# EAGLE schematic proto4 (EAGLE 6.6.0), part 1 of 2
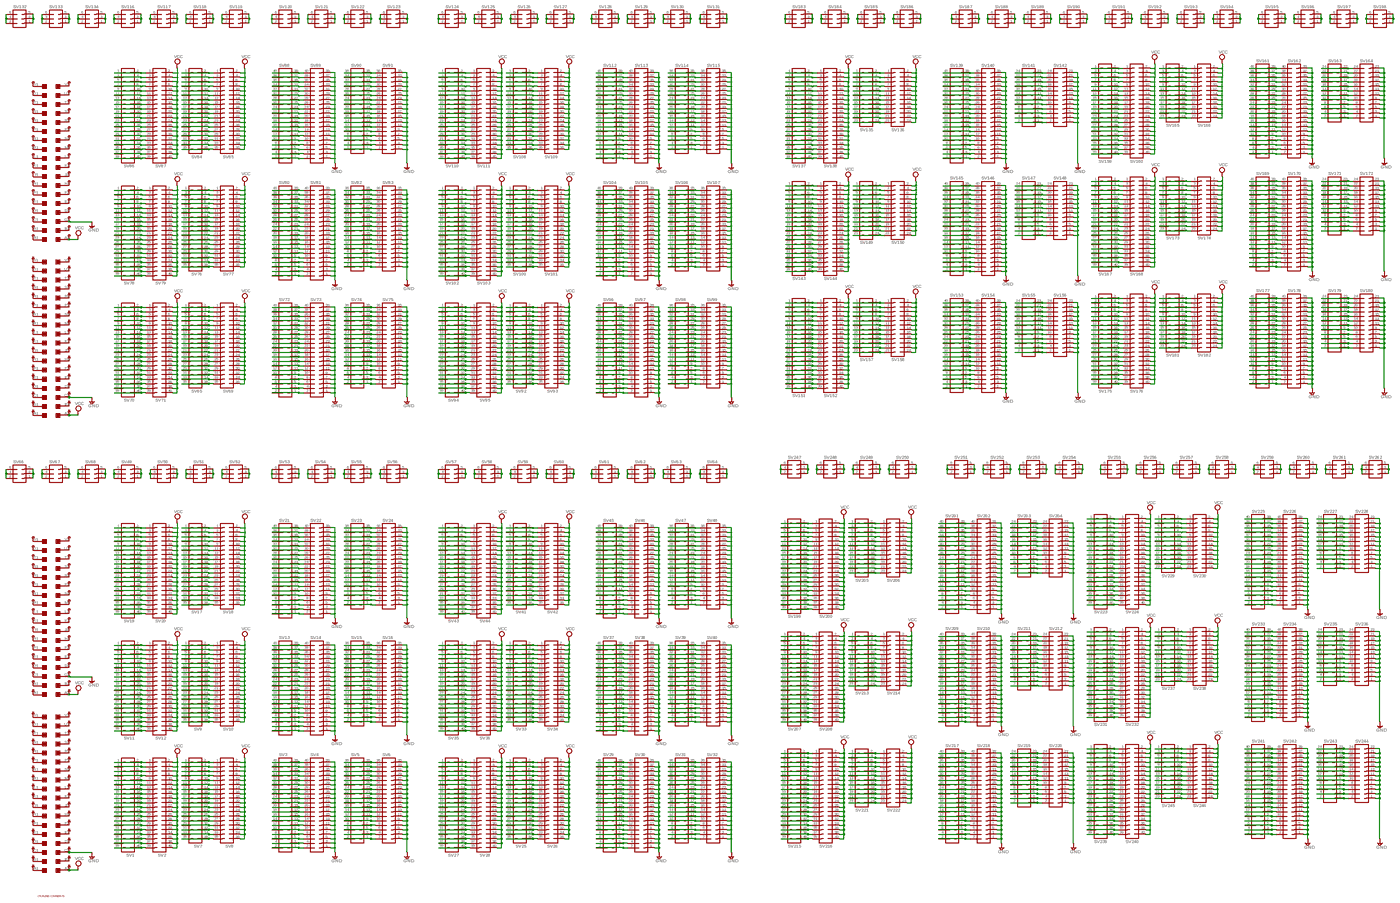
[diagram p0: schematic, sheet 1, overview]
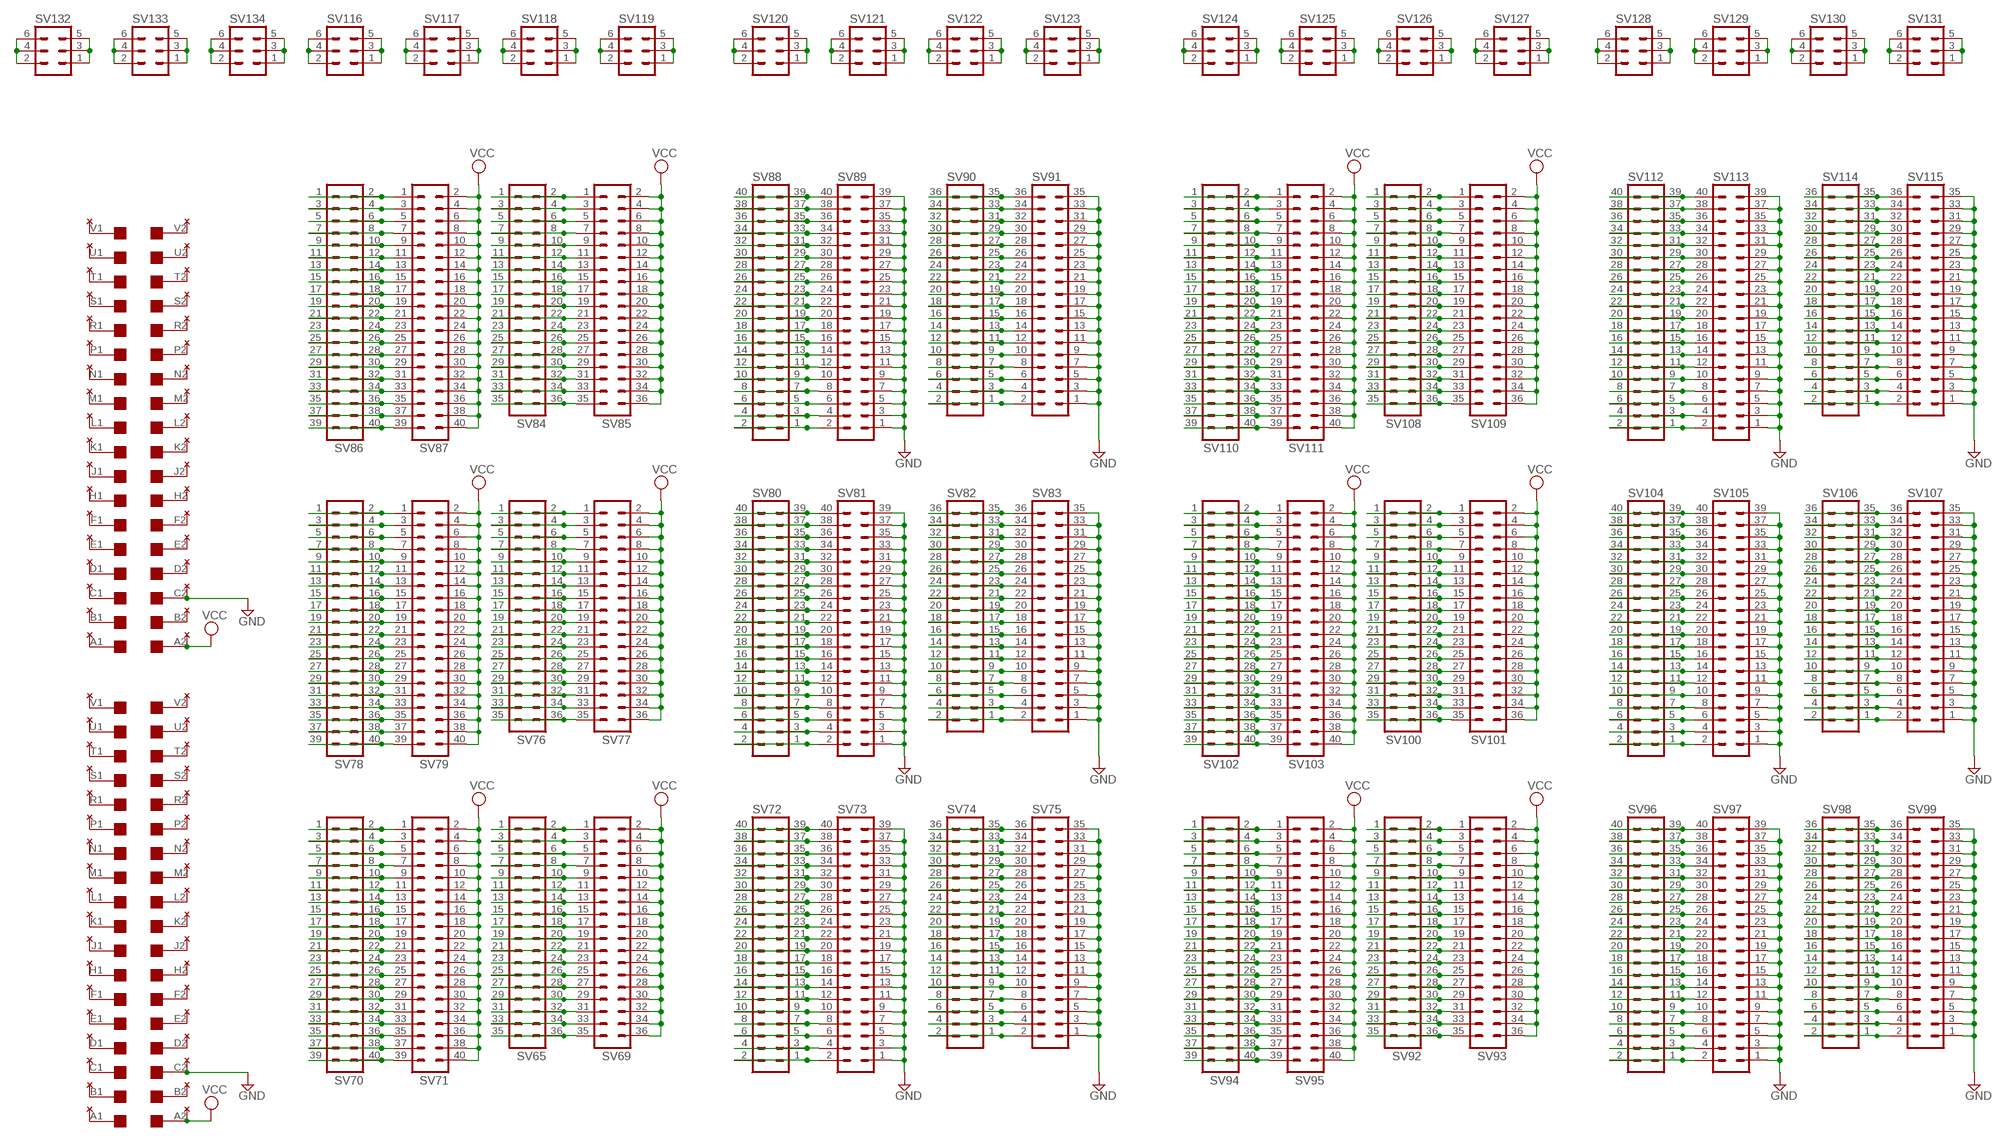
[diagram p1: schematic, sheet 1, part 1 of 4]
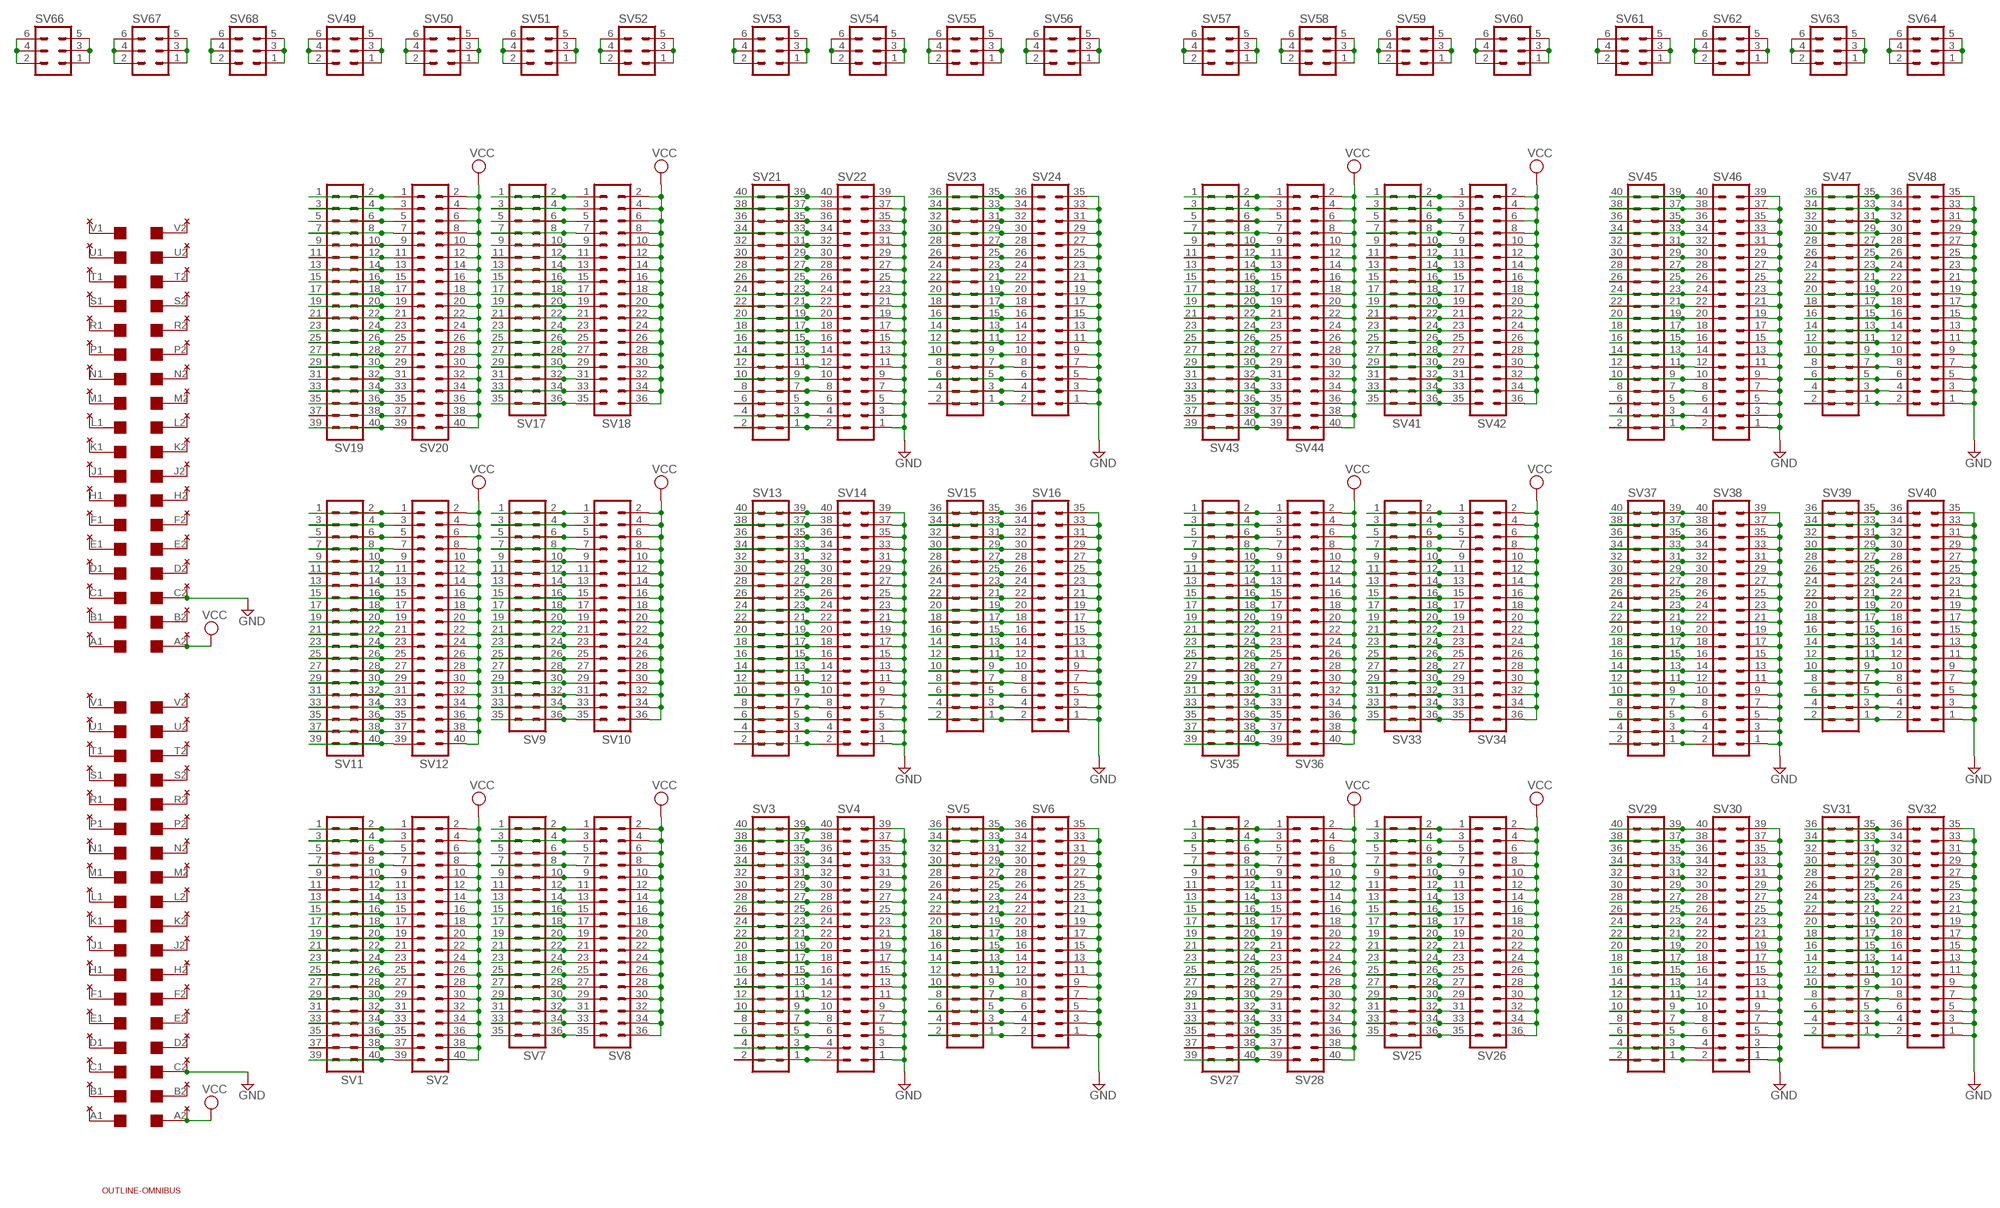
[diagram p2: schematic, sheet 1, part 2 of 4]
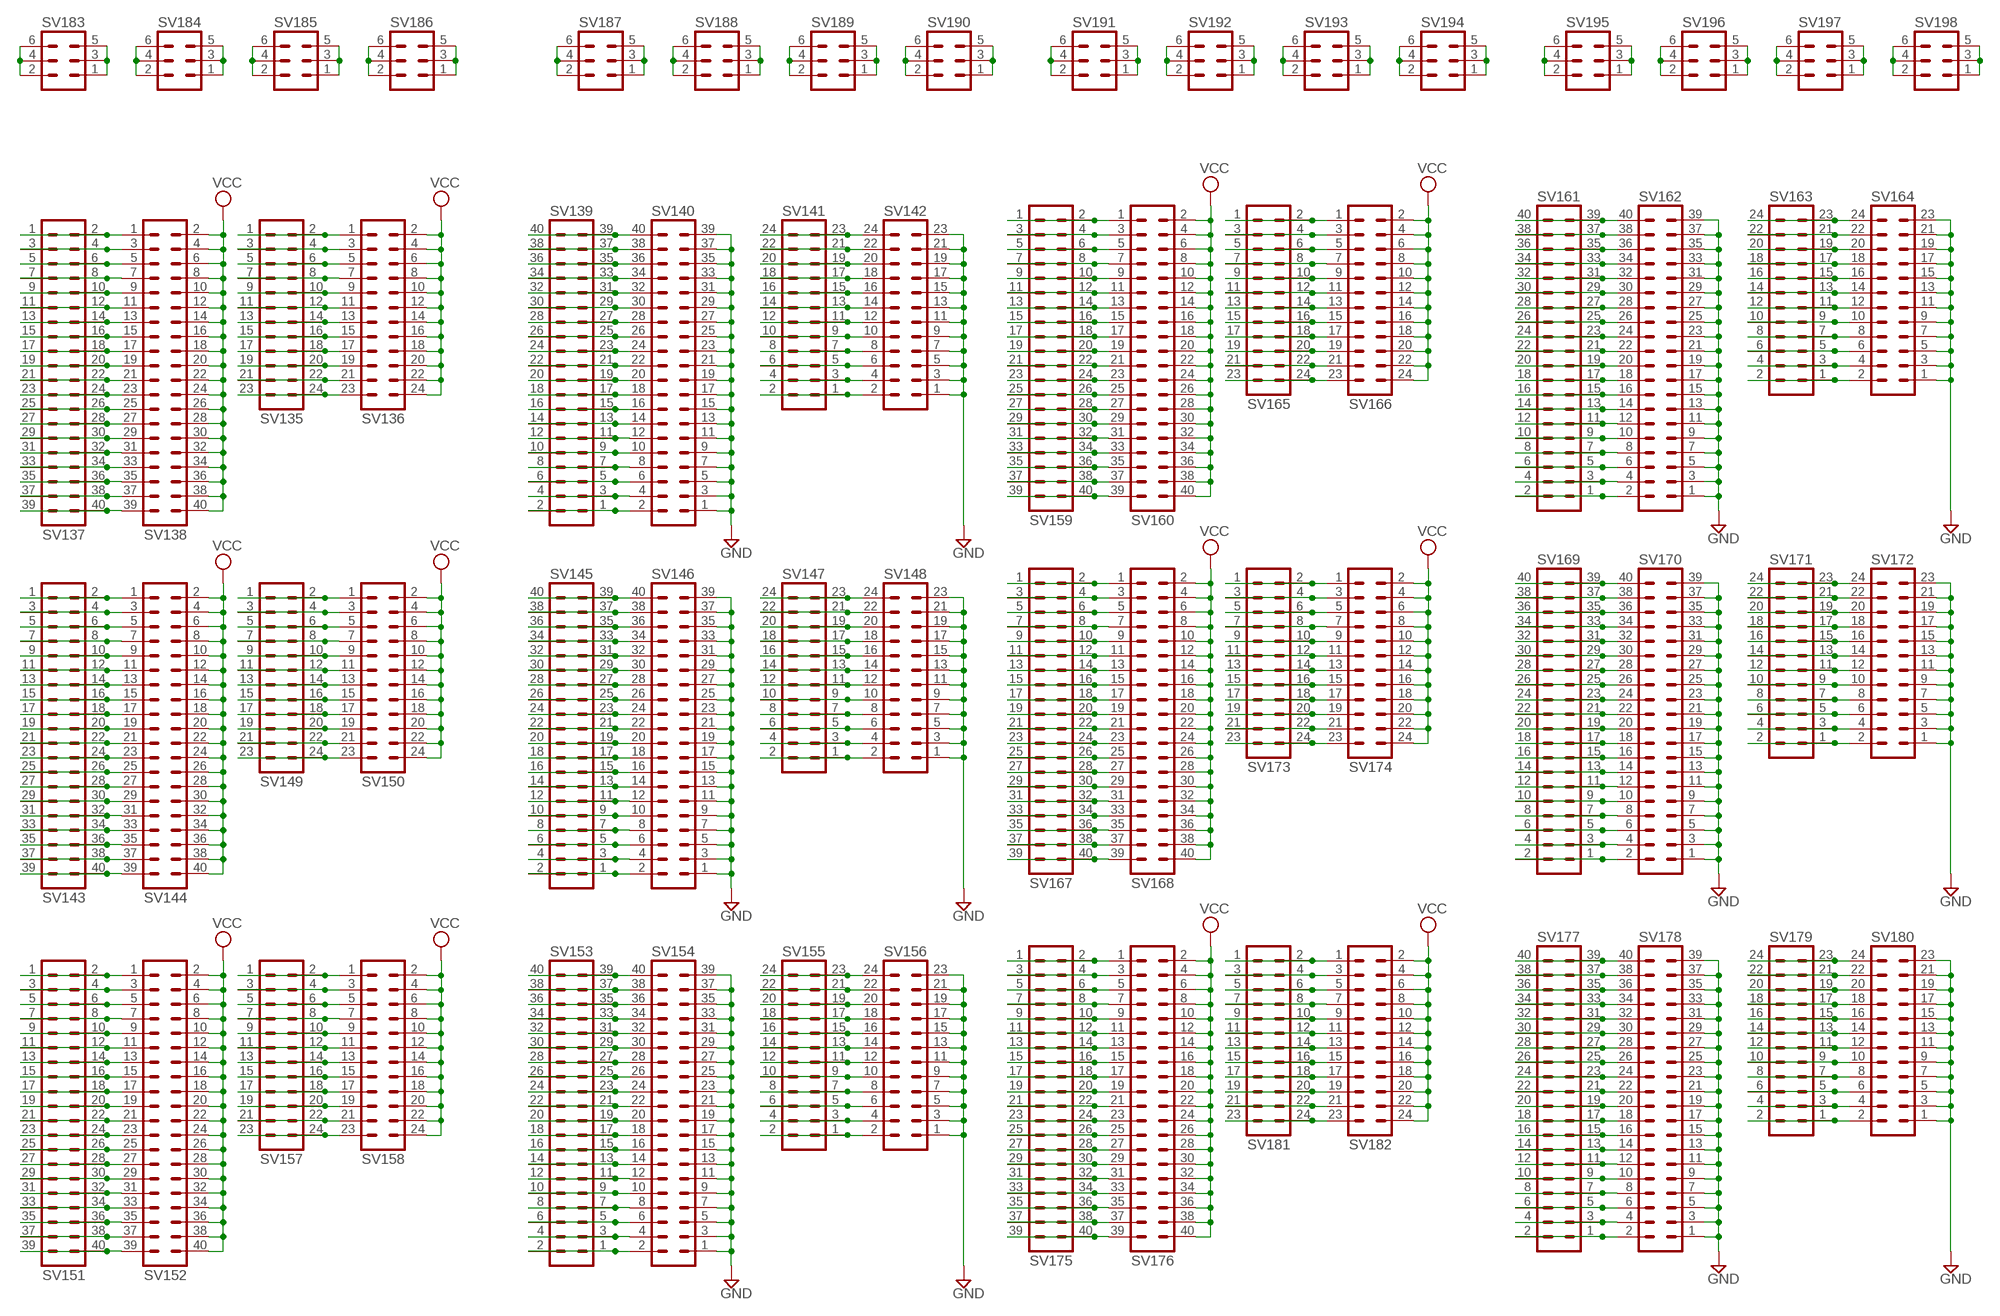
[diagram p3: schematic, sheet 1, part 3 of 4]
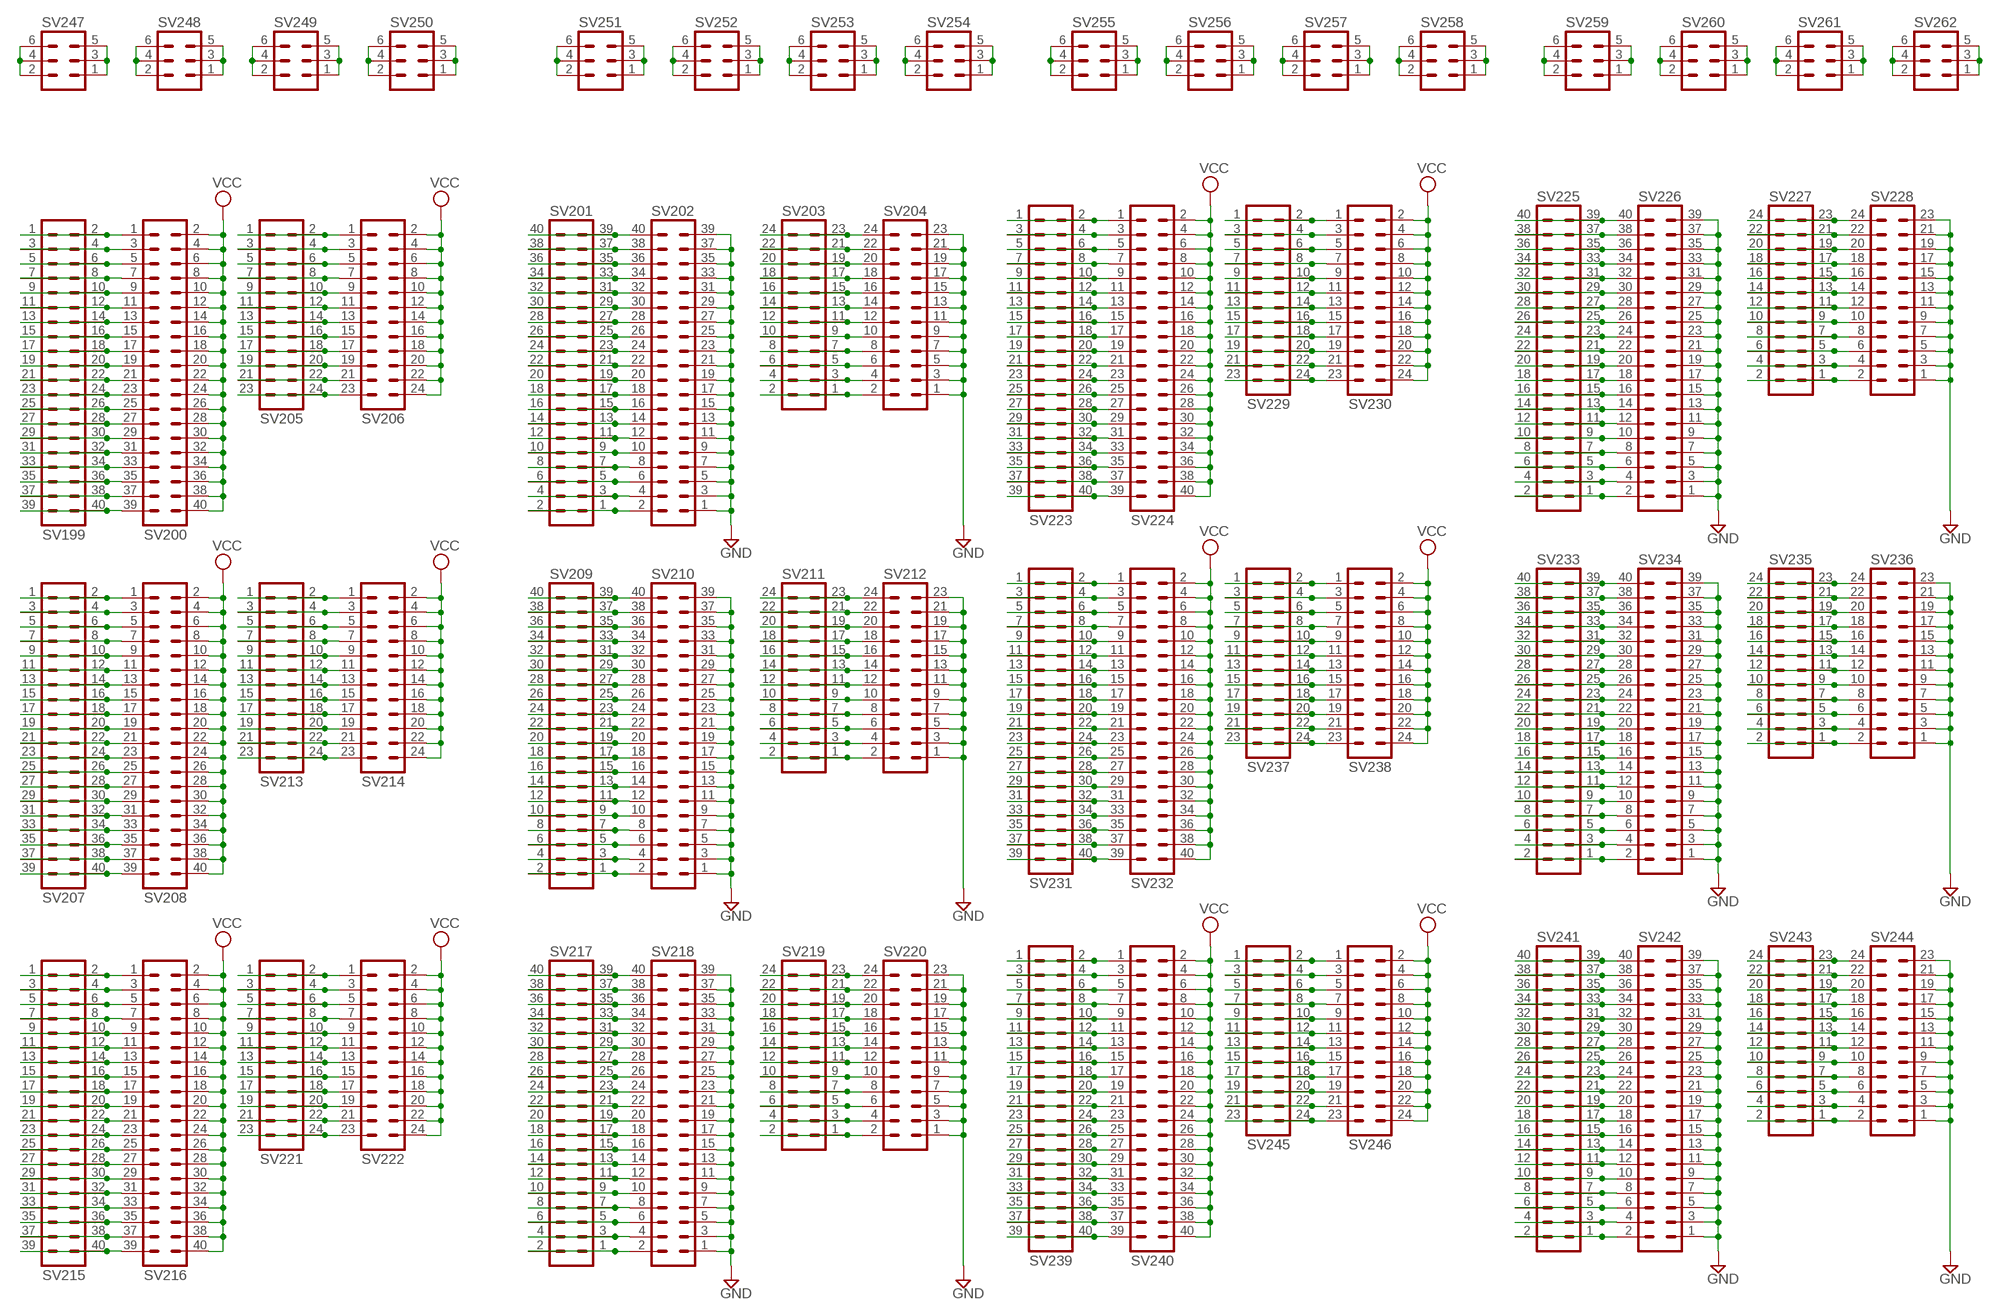
[diagram p4: schematic, sheet 1, part 4 of 4]

## Parts
A  EDGE-2CONNECTOR  [EDGE-CON2]
A1  EDGE-2CONNECTOR  [EDGE-CON2]
B  EDGE-2CONNECTOR  [EDGE-CON2]
B1  EDGE-2CONNECTOR  [EDGE-CON2]
SV1  MA20-2  [MA20-2]
SV2  MA20-2  [MA20-2]
SV3  MA20-2  [MA20-2]
SV4  MA20-2  [MA20-2]
SV5  MA18-2  [MA18-2]
SV6  MA18-2  [MA18-2]
SV7  MA18-2  [MA18-2]
SV8  MA18-2  [MA18-2]
SV9  MA18-2  [MA18-2]
SV10  MA18-2  [MA18-2]
SV11  MA20-2  [MA20-2]
SV12  MA20-2  [MA20-2]
SV13  MA20-2  [MA20-2]
SV14  MA20-2  [MA20-2]
SV15  MA18-2  [MA18-2]
SV16  MA18-2  [MA18-2]
SV17  MA18-2  [MA18-2]
SV18  MA18-2  [MA18-2]
SV19  MA20-2  [MA20-2]
SV20  MA20-2  [MA20-2]
SV21  MA20-2  [MA20-2]
SV22  MA20-2  [MA20-2]
SV23  MA18-2  [MA18-2]
SV24  MA18-2  [MA18-2]
SV25  MA18-2  [MA18-2]
SV26  MA18-2  [MA18-2]
SV27  MA20-2  [MA20-2]
SV28  MA20-2  [MA20-2]
SV29  MA20-2  [MA20-2]
SV30  MA20-2  [MA20-2]
SV31  MA18-2  [MA18-2]
SV32  MA18-2  [MA18-2]
SV33  MA18-2  [MA18-2]
SV34  MA18-2  [MA18-2]
SV35  MA20-2  [MA20-2]
SV36  MA20-2  [MA20-2]
SV37  MA20-2  [MA20-2]
SV38  MA20-2  [MA20-2]
SV39  MA18-2  [MA18-2]
SV40  MA18-2  [MA18-2]
SV41  MA18-2  [MA18-2]
SV42  MA18-2  [MA18-2]
SV43  MA20-2  [MA20-2]
SV44  MA20-2  [MA20-2]
SV45  MA20-2  [MA20-2]
SV46  MA20-2  [MA20-2]
SV47  MA18-2  [MA18-2]
SV48  MA18-2  [MA18-2]
SV49  MA03-2  [MA03-2]
SV50  MA03-2  [MA03-2]
SV51  MA03-2  [MA03-2]
SV52  MA03-2  [MA03-2]
SV53  MA03-2  [MA03-2]
SV54  MA03-2  [MA03-2]
SV55  MA03-2  [MA03-2]
SV56  MA03-2  [MA03-2]
SV57  MA03-2  [MA03-2]
SV58  MA03-2  [MA03-2]
SV59  MA03-2  [MA03-2]
SV60  MA03-2  [MA03-2]
SV61  MA03-2  [MA03-2]
SV62  MA03-2  [MA03-2]
SV63  MA03-2  [MA03-2]
SV64  MA03-2  [MA03-2]
SV65  MA18-2  [MA18-2]
SV66  MA03-2  [MA03-2]
SV67  MA03-2  [MA03-2]
SV68  MA03-2  [MA03-2]
SV69  MA18-2  [MA18-2]
SV70  MA20-2  [MA20-2]
SV71  MA20-2  [MA20-2]
SV72  MA20-2  [MA20-2]
SV73  MA20-2  [MA20-2]
SV74  MA18-2  [MA18-2]
SV75  MA18-2  [MA18-2]
SV76  MA18-2  [MA18-2]
SV77  MA18-2  [MA18-2]
SV78  MA20-2  [MA20-2]
SV79  MA20-2  [MA20-2]
SV80  MA20-2  [MA20-2]
SV81  MA20-2  [MA20-2]
SV82  MA18-2  [MA18-2]
SV83  MA18-2  [MA18-2]
SV84  MA18-2  [MA18-2]
SV85  MA18-2  [MA18-2]
SV86  MA20-2  [MA20-2]
SV87  MA20-2  [MA20-2]
SV88  MA20-2  [MA20-2]
SV89  MA20-2  [MA20-2]
SV90  MA18-2  [MA18-2]
SV91  MA18-2  [MA18-2]
SV92  MA18-2  [MA18-2]
SV93  MA18-2  [MA18-2]
SV94  MA20-2  [MA20-2]
SV95  MA20-2  [MA20-2]
SV96  MA20-2  [MA20-2]
SV97  MA20-2  [MA20-2]
SV98  MA18-2  [MA18-2]
SV99  MA18-2  [MA18-2]
SV100  MA18-2  [MA18-2]
SV101  MA18-2  [MA18-2]
SV102  MA20-2  [MA20-2]
SV103  MA20-2  [MA20-2]
SV104  MA20-2  [MA20-2]
SV105  MA20-2  [MA20-2]
SV106  MA18-2  [MA18-2]
SV107  MA18-2  [MA18-2]
SV108  MA18-2  [MA18-2]
SV109  MA18-2  [MA18-2]
SV110  MA20-2  [MA20-2]
SV111  MA20-2  [MA20-2]
SV112  MA20-2  [MA20-2]
SV113  MA20-2  [MA20-2]
SV114  MA18-2  [MA18-2]
SV115  MA18-2  [MA18-2]
SV116  MA03-2  [MA03-2]
SV117  MA03-2  [MA03-2]
SV118  MA03-2  [MA03-2]
SV119  MA03-2  [MA03-2]
SV120  MA03-2  [MA03-2]
SV121  MA03-2  [MA03-2]
SV122  MA03-2  [MA03-2]
SV123  MA03-2  [MA03-2]
SV124  MA03-2  [MA03-2]
SV125  MA03-2  [MA03-2]
SV126  MA03-2  [MA03-2]
SV127  MA03-2  [MA03-2]
SV128  MA03-2  [MA03-2]
SV129  MA03-2  [MA03-2]
SV130  MA03-2  [MA03-2]
SV131  MA03-2  [MA03-2]
SV132  MA03-2  [MA03-2]
SV133  MA03-2  [MA03-2]
SV134  MA03-2  [MA03-2]
SV135  MA12-2  [MA12-2]
SV136  MA12-2  [MA12-2]
SV137  MA20-2  [MA20-2]
SV138  MA20-2  [MA20-2]
SV139  MA20-2  [MA20-2]
SV140  MA20-2  [MA20-2]
SV141  MA12-2  [MA12-2]
SV142  MA12-2  [MA12-2]
SV143  MA20-2  [MA20-2]
SV144  MA20-2  [MA20-2]
SV145  MA20-2  [MA20-2]
SV146  MA20-2  [MA20-2]
SV147  MA12-2  [MA12-2]
SV148  MA12-2  [MA12-2]
SV149  MA12-2  [MA12-2]
SV150  MA12-2  [MA12-2]
SV151  MA20-2  [MA20-2]
SV152  MA20-2  [MA20-2]
SV153  MA20-2  [MA20-2]
SV154  MA20-2  [MA20-2]
SV155  MA12-2  [MA12-2]
SV156  MA12-2  [MA12-2]
SV157  MA12-2  [MA12-2]
SV158  MA12-2  [MA12-2]
SV159  MA20-2  [MA20-2]
SV160  MA20-2  [MA20-2]
SV161  MA20-2  [MA20-2]
SV162  MA20-2  [MA20-2]
SV163  MA12-2  [MA12-2]
SV164  MA12-2  [MA12-2]
SV165  MA12-2  [MA12-2]
SV166  MA12-2  [MA12-2]
SV167  MA20-2  [MA20-2]
SV168  MA20-2  [MA20-2]
SV169  MA20-2  [MA20-2]
SV170  MA20-2  [MA20-2]
SV171  MA12-2  [MA12-2]
SV172  MA12-2  [MA12-2]
SV173  MA12-2  [MA12-2]
SV174  MA12-2  [MA12-2]
SV175  MA20-2  [MA20-2]
SV176  MA20-2  [MA20-2]
SV177  MA20-2  [MA20-2]
SV178  MA20-2  [MA20-2]
SV179  MA12-2  [MA12-2]
SV180  MA12-2  [MA12-2]
SV181  MA12-2  [MA12-2]
SV182  MA12-2  [MA12-2]
SV183  MA03-2  [MA03-2]
SV184  MA03-2  [MA03-2]
SV185  MA03-2  [MA03-2]
SV186  MA03-2  [MA03-2]
SV187  MA03-2  [MA03-2]
SV188  MA03-2  [MA03-2]
SV189  MA03-2  [MA03-2]
SV190  MA03-2  [MA03-2]
SV191  MA03-2  [MA03-2]
SV192  MA03-2  [MA03-2]
SV193  MA03-2  [MA03-2]
SV194  MA03-2  [MA03-2]
SV195  MA03-2  [MA03-2]
SV196  MA03-2  [MA03-2]
SV197  MA03-2  [MA03-2]
SV198  MA03-2  [MA03-2]
SV199  MA20-2  [MA20-2]
SV200  MA20-2  [MA20-2]
SV201  MA20-2  [MA20-2]
SV202  MA20-2  [MA20-2]
SV203  MA12-2  [MA12-2]
SV204  MA12-2  [MA12-2]
SV205  MA12-2  [MA12-2]
SV206  MA12-2  [MA12-2]
SV207  MA20-2  [MA20-2]
SV208  MA20-2  [MA20-2]
SV209  MA20-2  [MA20-2]
SV210  MA20-2  [MA20-2]
SV211  MA12-2  [MA12-2]
SV212  MA12-2  [MA12-2]
SV213  MA12-2  [MA12-2]
SV214  MA12-2  [MA12-2]
SV215  MA20-2  [MA20-2]
SV216  MA20-2  [MA20-2]
SV217  MA20-2  [MA20-2]
SV218  MA20-2  [MA20-2]
SV219  MA12-2  [MA12-2]
SV220  MA12-2  [MA12-2]
SV221  MA12-2  [MA12-2]
SV222  MA12-2  [MA12-2]
SV223  MA20-2  [MA20-2]
SV224  MA20-2  [MA20-2]
SV225  MA20-2  [MA20-2]
SV226  MA20-2  [MA20-2]
SV227  MA12-2  [MA12-2]
SV228  MA12-2  [MA12-2]
SV229  MA12-2  [MA12-2]
SV230  MA12-2  [MA12-2]
SV231  MA20-2  [MA20-2]
SV232  MA20-2  [MA20-2]
SV233  MA20-2  [MA20-2]
SV234  MA20-2  [MA20-2]
SV235  MA12-2  [MA12-2]
SV236  MA12-2  [MA12-2]
SV237  MA12-2  [MA12-2]
SV238  MA12-2  [MA12-2]
SV239  MA20-2  [MA20-2]
SV240  MA20-2  [MA20-2]
SV241  MA20-2  [MA20-2]
SV242  MA20-2  [MA20-2]
SV243  MA12-2  [MA12-2]
SV244  MA12-2  [MA12-2]
SV245  MA12-2  [MA12-2]
SV246  MA12-2  [MA12-2]
SV247  MA03-2  [MA03-2]
SV248  MA03-2  [MA03-2]
SV249  MA03-2  [MA03-2]
SV250  MA03-2  [MA03-2]
SV251  MA03-2  [MA03-2]
SV252  MA03-2  [MA03-2]
SV253  MA03-2  [MA03-2]
SV254  MA03-2  [MA03-2]
SV255  MA03-2  [MA03-2]
SV256  MA03-2  [MA03-2]
SV257  MA03-2  [MA03-2]
SV258  MA03-2  [MA03-2]
SV259  MA03-2  [MA03-2]
SV260  MA03-2  [MA03-2]
SV261  MA03-2  [MA03-2]
SV262  MA03-2  [MA03-2]
U$1  THRU-HOLE2A  [THRU-HOLEA]
U$3  THRU-HOLE2A  [THRU-HOLEA]
U$5  THRU-HOLE2A  [THRU-HOLEA]
U$6  THRU-HOLE2A  [THRU-HOLEA]
U$7  OUTLINE-OMNIBUS  [OMNIBUS]

## Nets
GND: A1.C2 A.C2 B1.C2 B.C2 SV4.1 SV4.3 SV4.5 SV4.7 SV4.9 SV4.11 SV4.13 SV4.15 SV4.17 SV4.19 SV4.21 SV4.23 SV4.25 SV4.27 SV4.29 SV4.31 SV4.33 SV4.35 SV4.37 SV4.39 SV6.1 SV6.3 SV6.5 SV6.7 SV6.9 SV6.11 SV6.13 SV6.15 SV6.17 SV6.19 SV6.21 SV6.23 SV6.25 SV6.27 SV6.29 SV6.31 SV6.33 SV6.35 SV14.1 SV14.3 SV14.5 SV14.7 SV14.9 SV14.11 SV14.13 SV14.15 SV14.17 SV14.19 SV14.21 SV14.23 SV14.25 SV14.27 SV14.29 SV14.31 SV14.33 SV14.35 SV14.37 SV14.39 SV16.1 SV16.3 SV16.5 SV16.7 SV16.9 SV16.11 SV16.13 SV16.15 SV16.17 SV16.19 SV16.21 SV16.23 SV16.25 SV16.27 SV16.29 SV16.31 SV16.33 SV16.35 SV22.1 SV22.3 SV22.5 SV22.7 SV22.9 SV22.11 SV22.13 SV22.15 SV22.17 SV22.19 SV22.21 SV22.23 SV22.25 SV22.27 SV22.29 SV22.31 SV22.33 SV22.35 SV22.37 SV22.39 SV24.1 SV24.3 SV24.5 SV24.7 SV24.9 SV24.11 SV24.13 SV24.15 SV24.17 SV24.19 SV24.21 SV24.23 SV24.25 SV24.27 SV24.29 SV24.31 SV24.33 SV24.35 SV30.1 SV30.3 SV30.5 SV30.7 SV30.9 SV30.11 SV30.13 SV30.15 SV30.17 SV30.19 SV30.21 SV30.23 SV30.25 SV30.27 SV30.29 SV30.31 SV30.33 SV30.35 SV30.37 SV30.39 SV32.1 SV32.3 SV32.5 SV32.7 SV32.9 SV32.11 SV32.13 SV32.15 SV32.17 SV32.19 SV32.21 SV32.23 SV32.25 SV32.27 SV32.29 SV32.31 SV32.33 SV32.35 SV38.1 SV38.3 SV38.5 SV38.7 SV38.9 SV38.11 SV38.13 SV38.15 SV38.17 SV38.19 SV38.21 SV38.23 SV38.25 SV38.27 SV38.29 SV38.31 SV38.33 SV38.35 SV38.37 SV38.39 SV40.1 SV40.3 SV40.5 SV40.7 SV40.9 SV40.11 SV40.13 SV40.15 SV40.17 SV40.19 SV40.21 SV40.23 SV40.25 SV40.27 SV40.29 SV40.31 SV40.33 SV40.35 SV46.1 SV46.3 SV46.5 SV46.7 SV46.9 SV46.11 SV46.13 SV46.15 SV46.17 SV46.19 SV46.21 SV46.23 SV46.25 SV46.27 SV46.29 SV46.31 SV46.33 SV46.35 SV46.37 SV46.39 SV48.1 SV48.3 SV48.5 SV48.7 SV48.9 SV48.11 SV48.13 SV48.15 SV48.17 SV48.19 SV48.21 SV48.23 SV48.25 SV48.27 SV48.29 SV48.31 SV48.33 SV48.35 SV73.1 SV73.3 SV73.5 SV73.7 SV73.9 SV73.11 SV73.13 SV73.15 SV73.17 SV73.19 SV73.21 SV73.23 SV73.25 SV73.27 SV73.29 SV73.31 SV73.33 SV73.35 SV73.37 SV73.39 SV75.1 SV75.3 SV75.5 SV75.7 SV75.9 SV75.11 SV75.13 SV75.15 SV75.17 SV75.19 SV75.21 SV75.23 SV75.25 SV75.27 SV75.29 SV75.31 SV75.33 SV75.35 SV81.1 SV81.3 SV81.5 SV81.7 SV81.9 SV81.11 SV81.13 SV81.15 SV81.17 SV81.19 SV81.21 SV81.23 SV81.25 SV81.27 SV81.29 SV81.31 SV81.33 SV81.35 SV81.37 SV81.39 SV83.1 SV83.3 SV83.5 SV83.7 SV83.9 SV83.11 SV83.13 SV83.15 SV83.17 SV83.19 SV83.21 SV83.23 SV83.25 SV83.27 SV83.29 SV83.31 SV83.33 SV83.35 SV89.1 SV89.3 SV89.5 SV89.7 SV89.9 SV89.11 SV89.13 SV89.15 SV89.17 SV89.19 SV89.21 SV89.23 SV89.25 SV89.27 SV89.29 SV89.31 SV89.33 SV89.35 SV89.37 SV89.39 SV91.1 SV91.3 SV91.5 SV91.7 SV91.9 SV91.11 SV91.13 SV91.15 SV91.17 SV91.19 SV91.21 SV91.23 SV91.25 SV91.27 SV91.29 SV91.31 SV91.33 SV91.35 SV97.1 SV97.3 SV97.5 SV97.7 SV97.9 SV97.11 SV97.13 SV97.15 SV97.17 SV97.19 SV97.21 SV97.23 SV97.25 SV97.27 SV97.29 SV97.31 SV97.33 SV97.35 SV97.37 SV97.39 SV99.1 SV99.3 SV99.5 SV99.7 SV99.9 SV99.11 SV99.13 SV99.15 SV99.17 SV99.19 SV99.21 SV99.23 SV99.25 SV99.27 SV99.29 SV99.31 SV99.33 SV99.35 SV105.1 SV105.3 SV105.5 SV105.7 SV105.9 SV105.11 SV105.13 SV105.15 SV105.17 SV105.19 SV105.21 SV105.23 SV105.25 SV105.27 SV105.29 SV105.31 SV105.33 SV105.35 SV105.37 SV105.39 SV107.1 SV107.3 SV107.5 SV107.7 SV107.9 SV107.11 SV107.13 SV107.15 SV107.17 SV107.19 SV107.21 SV107.23 SV107.25 SV107.27 SV107.29 SV107.31 SV107.33 SV107.35 SV113.1 SV113.3 SV113.5 SV113.7 SV113.9 SV113.11 SV113.13 SV113.15 SV113.17 SV113.19 SV113.21 SV113.23 SV113.25 SV113.27 SV113.29 SV113.31 SV113.33 SV113.35 SV113.37 SV113.39 SV115.1 SV115.3 SV115.5 SV115.7 SV115.9 SV115.11 SV115.13 SV115.15 SV115.17 SV115.19 SV115.21 SV115.23 SV115.25 SV115.27 SV115.29 SV115.31 SV115.33 SV115.35 SV140.1 SV140.3 SV140.5 SV140.7 SV140.9 SV140.11 SV140.13 SV140.15 SV140.17 SV140.19 SV140.21 SV140.23 SV140.25 SV140.27 SV140.29 SV140.31 SV140.33 SV140.35 SV140.37 SV140.39 SV142.1 SV142.3 SV142.5 SV142.7 SV142.9 SV142.11 SV142.13 SV142.15 SV142.17 SV142.19 SV142.21 SV142.23 SV146.1 SV146.3 SV146.5 SV146.7 SV146.9 SV146.11 SV146.13 SV146.15 SV146.17 SV146.19 SV146.21 SV146.23 SV146.25 SV146.27 SV146.29 SV146.31 SV146.33 SV146.35 SV146.37 SV146.39 SV148.1 SV148.3 SV148.5 SV148.7 SV148.9 SV148.11 SV148.13 SV148.15 SV148.17 SV148.19 SV148.21 SV148.23 SV154.1 SV154.3 SV154.5 SV154.7 SV154.9 SV154.11 SV154.13 SV154.15 SV154.17 SV154.19 SV154.21 SV154.23 SV154.25 SV154.27 SV154.29 SV154.31 SV154.33 SV154.35 SV154.37 SV154.39 SV156.1 SV156.3 SV156.5 SV156.7 SV156.9 SV156.11 SV156.13 SV156.15 SV156.17 SV156.19 SV156.21 SV156.23 SV162.1 SV162.3 SV162.5 SV162.7 SV162.9 SV162.11 SV162.13 SV162.15 SV162.17 SV162.19 SV162.21 SV162.23 SV162.25 SV162.27 SV162.29 SV162.31 SV162.33 SV162.35 SV162.37 SV162.39 SV164.1 SV164.3 SV164.5 SV164.7 SV164.9 SV164.11 SV164.13 SV164.15 SV164.17 SV164.19 SV164.21 SV164.23 SV170.1 SV170.3 SV170.5 SV170.7 SV170.9 SV170.11 SV170.13 SV170.15 SV170.17 SV170.19 SV170.21 SV170.23 SV170.25 SV170.27 SV170.29 SV170.31 SV170.33 SV170.35 SV170.37 SV170.39 SV172.1 SV172.3 SV172.5 SV172.7 SV172.9 SV172.11 SV172.13 SV172.15 SV172.17 SV172.19 SV172.21 SV172.23 SV178.1 SV178.3 SV178.5 SV178.7 SV178.9 SV178.11 SV178.13 SV178.15 SV178.17 SV178.19 SV178.21 SV178.23 SV178.25 SV178.27 SV178.29 SV178.31 SV178.33 SV178.35 SV178.37 SV178.39 SV180.1 SV180.3 SV180.5 SV180.7 SV180.9 SV180.11 SV180.13 SV180.15 SV180.17 SV180.19 SV180.21 SV180.23 SV202.1 SV202.3 SV202.5 SV202.7 SV202.9 SV202.11 SV202.13 SV202.15 SV202.17 SV202.19 SV202.21 SV202.23 SV202.25 SV202.27 SV202.29 SV202.31 SV202.33 SV202.35 SV202.37 SV202.39 SV204.1 SV204.3 SV204.5 SV204.7 SV204.9 SV204.11 SV204.13 SV204.15 SV204.17 SV204.19 SV204.21 SV204.23 SV210.1 SV210.3 SV210.5 SV210.7 SV210.9 SV210.11 SV210.13 SV210.15 SV210.17 SV210.19 SV210.21 SV210.23 SV210.25 SV210.27 SV210.29 SV210.31 SV210.33 SV210.35 SV210.37 SV210.39 SV212.1 SV212.3 SV212.5 SV212.7 SV212.9 SV212.11 SV212.13 SV212.15 SV212.17 SV212.19 SV212.21 SV212.23 SV218.1 SV218.3 SV218.5 SV218.7 SV218.9 SV218.11 SV218.13 SV218.15 SV218.17 SV218.19 SV218.21 SV218.23 SV218.25 SV218.27 SV218.29 SV218.31 SV218.33 SV218.35 SV218.37 SV218.39 SV220.1 SV220.3 SV220.5 SV220.7 SV220.9 SV220.11 SV220.13 SV220.15 SV220.17 SV220.19 SV220.21 SV220.23 SV226.1 SV226.3 SV226.5 SV226.7 SV226.9 SV226.11 SV226.13 SV226.15 SV226.17 SV226.19 SV226.21 SV226.23 SV226.25 SV226.27 SV226.29 SV226.31 SV226.33 SV226.35 SV226.37 SV226.39 SV228.1 SV228.3 SV228.5 SV228.7 SV228.9 SV228.11 SV228.13 SV228.15 SV228.17 SV228.19 SV228.21 SV228.23 SV234.1 SV234.3 SV234.5 SV234.7 SV234.9 SV234.11 SV234.13 SV234.15 SV234.17 SV234.19 SV234.21 SV234.23 SV234.25 SV234.27 SV234.29 SV234.31 SV234.33 SV234.35 SV234.37 SV234.39 SV236.1 SV236.3 SV236.5 SV236.7 SV236.9 SV236.11 SV236.13 SV236.15 SV236.17 SV236.19 SV236.21 SV236.23 SV242.1 SV242.3 SV242.5 SV242.7 SV242.9 SV242.11 SV242.13 SV242.15 SV242.17 SV242.19 SV242.21 SV242.23 SV242.25 SV242.27 SV242.29 SV242.31 SV242.33 SV242.35 SV242.37 SV242.39 SV244.1 SV244.3 SV244.5 SV244.7 SV244.9 SV244.11 SV244.13 SV244.15 SV244.17 SV244.19 SV244.21 SV244.23 U$1.C2 U$3.C2 U$5.C2 U$6.C2
N$1: A.K2 U$3.K2
N$2: A.J2 U$3.J2
N$3: A.H2 U$3.H2
N$4: A.L2 U$3.L2
N$5: A.M2 U$3.M2
N$6: A.N2 U$3.N2
N$7: A.P2 U$3.P2
N$8: A.F2 U$3.F2
N$9: A.E2 U$3.E2
N$10: A.D2 U$3.D2
N$11: SV1.1 SV1.2 SV2.1
N$12: A.R2 U$3.R2
N$13: A.S2 U$3.S2
N$14: A.B2 U$3.B2
N$15: SV1.3 SV1.4 SV2.3
N$16: A.T2 U$3.T2
N$17: A.U2 U$3.U2
N$18: A.V2 U$3.V2
N$19: A.A1 U$3.A1
N$20: A.V1 U$3.V1
N$21: A.U1 U$3.U1
N$22: A.T1 U$3.T1
N$23: A.S1 U$3.S1
N$24: A.R1 U$3.R1
N$25: A.P1 U$3.P1
N$26: A.N1 U$3.N1
N$27: A.M1 U$3.M1
N$28: A.L1 U$3.L1
N$29: A.K1 U$3.K1
N$30: A.J1 U$3.J1
N$31: A.H1 U$3.H1
N$32: A.F1 U$3.F1
N$33: A.E1 U$3.E1
N$34: A.D1 U$3.D1
N$35: A.C1 U$3.C1
N$36: A.B1 U$3.B1
N$37: SV1.5 SV1.6 SV2.5
N$38: SV7.1 SV7.2 SV8.1
N$39: SV7.3 SV7.4 SV8.3
N$40: SV7.5 SV7.6 SV8.5
N$41: SV7.7 SV7.8 SV8.7
N$42: SV7.9 SV7.10 SV8.9
N$43: SV7.11 SV7.12 SV8.11
N$44: SV7.13 SV7.14 SV8.13
N$45: SV1.7 SV1.8 SV2.7
N$46: SV1.9 SV1.10 SV2.9
N$47: SV1.11 SV1.12 SV2.11
N$48: SV1.13 SV1.14 SV2.13
N$49: SV1.15 SV1.16 SV2.15
N$50: SV1.17 SV1.18 SV2.17
N$51: SV1.19 SV1.20 SV2.19
N$52: SV1.21 SV1.22 SV2.21
N$53: SV1.23 SV1.24 SV2.23
N$54: SV1.25 SV1.26 SV2.25
N$55: SV1.27 SV1.28 SV2.27
N$56: SV1.29 SV1.30 SV2.29
N$57: SV1.31 SV1.32 SV2.31
N$58: SV1.33 SV1.34 SV2.33
N$59: SV1.35 SV1.36 SV2.35
N$60: SV1.37 SV1.38 SV2.37
N$61: SV1.39 SV1.40 SV2.39
N$62: SV7.15 SV7.16 SV8.15
N$63: SV7.17 SV7.18 SV8.17
N$64: SV7.19 SV7.20 SV8.19
N$65: SV7.21 SV7.22 SV8.21
N$66: SV7.23 SV7.24 SV8.23
N$67: SV7.25 SV7.26 SV8.25
N$68: SV7.27 SV7.28 SV8.27
N$69: SV7.29 SV7.30 SV8.29
N$70: SV7.31 SV7.32 SV8.31
N$71: SV7.33 SV7.34 SV8.33
N$72: SV7.35 SV7.36 SV8.35
N$73: SV3.39 SV3.40 SV4.40
N$74: SV3.37 SV3.38 SV4.38
N$75: SV3.35 SV3.36 SV4.36
N$76: SV3.33 SV3.34 SV4.34
N$77: SV3.31 SV3.32 SV4.32
N$78: SV3.29 SV3.30 SV4.30
N$79: SV3.27 SV3.28 SV4.28
N$80: SV3.25 SV3.26 SV4.26
N$81: SV3.23 SV3.24 SV4.24
N$82: SV3.21 SV3.22 SV4.22
N$83: SV3.19 SV3.20 SV4.20
N$84: SV3.17 SV3.18 SV4.18
N$85: SV3.15 SV3.16 SV4.16
N$86: SV3.13 SV3.14 SV4.14
N$87: SV3.11 SV3.12 SV4.12
N$88: SV3.9 SV3.10 SV4.10
N$89: SV3.7 SV3.8 SV4.8
N$90: SV3.5 SV3.6 SV4.6
N$91: SV3.3 SV3.4 SV4.4
N$92: SV3.1 SV3.2 SV4.2
N$93: SV11.1 SV11.2 SV12.1
N$94: SV5.35 SV5.36 SV6.36
N$95: SV5.33 SV5.34 SV6.34
N$96: SV5.31 SV5.32 SV6.32
N$97: SV5.29 SV5.30 SV6.30
N$98: SV5.27 SV5.28 SV6.28
N$99: SV5.25 SV5.26 SV6.26
N$100: SV5.23 SV5.24 SV6.24
N$101: SV5.21 SV5.22 SV6.22
N$102: SV5.19 SV5.20 SV6.20
N$103: SV5.17 SV5.18 SV6.18
N$104: SV5.15 SV5.16 SV6.16
N$105: SV5.13 SV5.14 SV6.14
N$106: SV5.11 SV5.12 SV6.12
N$107: SV5.9 SV5.10 SV6.10
N$108: SV5.7 SV5.8 SV6.8
N$109: SV5.5 SV5.6 SV6.6
N$110: SV5.3 SV5.4 SV6.4
N$111: SV5.1 SV5.2 SV6.2
N$112: SV11.3 SV11.4 SV12.3
N$113: SV11.5 SV11.6 SV12.5
N$114: SV11.7 SV11.8 SV12.7
N$115: SV11.9 SV11.10 SV12.9
N$116: SV11.11 SV11.12 SV12.11
N$117: SV11.13 SV11.14 SV12.13
N$118: SV11.15 SV11.16 SV12.15
N$119: SV11.17 SV11.18 SV12.17
N$120: SV11.19 SV11.20 SV12.19
N$121: SV11.21 SV11.22 SV12.21
N$122: SV11.23 SV11.24 SV12.23
N$123: SV11.25 SV11.26 SV12.25
N$124: SV11.27 SV11.28 SV12.27
N$125: SV11.29 SV11.30 SV12.29
N$126: SV11.31 SV11.32 SV12.31
N$127: SV11.33 SV11.34 SV12.33
N$128: SV11.35 SV11.36 SV12.35
N$129: SV11.37 SV11.38 SV12.37
N$130: SV11.39 SV11.40 SV12.39
N$131: SV9.1 SV9.2 SV10.1
N$132: SV9.3 SV9.4 SV10.3
N$133: SV9.5 SV9.6 SV10.5
N$134: SV9.7 SV9.8 SV10.7
N$135: SV9.9 SV9.10 SV10.9
N$136: SV9.11 SV9.12 SV10.11
N$137: SV9.13 SV9.14 SV10.13
N$138: SV9.15 SV9.16 SV10.15
N$139: SV9.17 SV9.18 SV10.17
N$140: SV9.19 SV9.20 SV10.19
N$141: SV9.21 SV9.22 SV10.21
N$142: SV9.23 SV9.24 SV10.23
N$143: SV9.25 SV9.26 SV10.25
N$144: SV9.27 SV9.28 SV10.27
N$145: SV9.29 SV9.30 SV10.29
N$146: SV9.31 SV9.32 SV10.31
N$147: SV9.33 SV9.34 SV10.33
N$148: SV9.35 SV9.36 SV10.35
N$149: SV13.39 SV13.40 SV14.40
N$150: SV13.37 SV13.38 SV14.38
N$151: SV13.35 SV13.36 SV14.36
N$152: SV13.33 SV13.34 SV14.34
N$153: SV13.31 SV13.32 SV14.32
N$154: SV13.29 SV13.30 SV14.30
N$155: SV13.27 SV13.28 SV14.28
N$156: SV13.25 SV13.26 SV14.26
N$157: SV13.23 SV13.24 SV14.24
N$158: SV13.21 SV13.22 SV14.22
N$159: SV13.19 SV13.20 SV14.20
N$160: SV13.17 SV13.18 SV14.18
N$161: SV13.15 SV13.16 SV14.16
N$162: SV13.13 SV13.14 SV14.14
N$163: SV13.11 SV13.12 SV14.12
N$164: SV13.9 SV13.10 SV14.10
N$165: SV13.7 SV13.8 SV14.8
N$166: SV13.5 SV13.6 SV14.6
N$167: SV13.3 SV13.4 SV14.4
N$168: SV13.1 SV13.2 SV14.2
N$169: SV15.35 SV15.36 SV16.36
N$170: SV15.33 SV15.34 SV16.34
N$171: SV15.31 SV15.32 SV16.32
N$172: SV15.29 SV15.30 SV16.30
N$173: SV15.27 SV15.28 SV16.28
N$174: SV15.25 SV15.26 SV16.26
N$175: SV15.23 SV15.24 SV16.24
N$176: SV15.21 SV15.22 SV16.22
N$177: SV15.19 SV15.20 SV16.20
N$178: SV15.17 SV15.18 SV16.18
N$179: SV15.15 SV15.16 SV16.16
N$180: SV15.13 SV15.14 SV16.14
N$181: SV15.11 SV15.12 SV16.12
N$182: SV15.9 SV15.10 SV16.10
N$183: SV15.7 SV15.8 SV16.8
N$184: SV15.5 SV15.6 SV16.6
N$185: SV15.3 SV15.4 SV16.4
N$186: SV15.1 SV15.2 SV16.2
N$187: SV19.1 SV19.2 SV20.1
N$188: SV19.3 SV19.4 SV20.3
N$189: SV19.5 SV19.6 SV20.5
N$190: SV19.7 SV19.8 SV20.7
N$191: SV19.9 SV19.10 SV20.9
N$192: SV19.11 SV19.12 SV20.11
N$193: SV19.13 SV19.14 SV20.13
N$194: SV19.15 SV19.16 SV20.15
N$195: SV19.17 SV19.18 SV20.17
N$196: SV19.19 SV19.20 SV20.19
N$197: SV19.21 SV19.22 SV20.21
N$198: SV19.23 SV19.24 SV20.23
N$199: SV19.25 SV19.26 SV20.25
N$200: SV19.27 SV19.28 SV20.27
N$201: SV19.29 SV19.30 SV20.29
N$202: SV19.31 SV19.32 SV20.31
N$203: SV19.33 SV19.34 SV20.33
N$204: SV19.35 SV19.36 SV20.35
N$205: SV19.37 SV19.38 SV20.37
N$206: SV19.39 SV19.40 SV20.39
N$207: SV17.1 SV17.2 SV18.1
N$208: SV17.3 SV17.4 SV18.3
N$209: SV17.5 SV17.6 SV18.5
N$210: SV17.7 SV17.8 SV18.7
N$211: SV17.9 SV17.10 SV18.9
N$212: SV17.11 SV17.12 SV18.11
N$213: SV17.13 SV17.14 SV18.13
N$214: SV17.15 SV17.16 SV18.15
N$215: SV17.17 SV17.18 SV18.17
N$216: SV17.19 SV17.20 SV18.19
N$217: SV17.21 SV17.22 SV18.21
N$218: SV17.23 SV17.24 SV18.23
N$219: SV17.25 SV17.26 SV18.25
N$220: SV17.27 SV17.28 SV18.27
N$221: SV17.29 SV17.30 SV18.29
N$222: SV17.31 SV17.32 SV18.31
N$223: SV17.33 SV17.34 SV18.33
N$224: SV17.35 SV17.36 SV18.35
N$225: SV21.39 SV21.40 SV22.40
N$226: SV21.37 SV21.38 SV22.38
N$227: SV21.35 SV21.36 SV22.36
N$228: SV21.33 SV21.34 SV22.34
N$229: SV21.31 SV21.32 SV22.32
N$230: SV21.29 SV21.30 SV22.30
N$231: SV21.27 SV21.28 SV22.28
N$232: SV21.25 SV21.26 SV22.26
N$233: SV21.23 SV21.24 SV22.24
N$234: SV21.21 SV21.22 SV22.22
N$235: SV21.19 SV21.20 SV22.20
N$236: SV21.17 SV21.18 SV22.18
N$237: SV21.15 SV21.16 SV22.16
N$238: SV21.13 SV21.14 SV22.14
N$239: SV21.11 SV21.12 SV22.12
N$240: SV21.9 SV21.10 SV22.10
N$241: SV21.7 SV21.8 SV22.8
N$242: SV21.5 SV21.6 SV22.6
N$243: SV21.3 SV21.4 SV22.4
N$244: SV21.1 SV21.2 SV22.2
N$245: SV23.35 SV23.36 SV24.36
N$246: SV23.33 SV23.34 SV24.34
N$247: SV23.31 SV23.32 SV24.32
N$248: SV23.29 SV23.30 SV24.30
N$249: SV23.27 SV23.28 SV24.28
N$250: SV23.25 SV23.26 SV24.26
N$251: SV23.23 SV23.24 SV24.24
N$252: SV23.21 SV23.22 SV24.22
N$253: SV23.19 SV23.20 SV24.20
N$254: SV23.17 SV23.18 SV24.18
N$255: SV23.15 SV23.16 SV24.16
N$256: SV23.13 SV23.14 SV24.14
N$257: SV23.11 SV23.12 SV24.12
N$258: SV23.9 SV23.10 SV24.10
N$259: SV23.7 SV23.8 SV24.8
N$260: SV23.5 SV23.6 SV24.6
N$261: SV23.3 SV23.4 SV24.4
N$262: SV23.1 SV23.2 SV24.2
N$263: B.K2 U$5.K2
N$264: B.J2 U$5.J2
N$265: B.H2 U$5.H2
N$266: B.L2 U$5.L2
N$267: B.M2 U$5.M2
N$268: B.N2 U$5.N2
N$269: B.P2 U$5.P2
N$270: B.F2 U$5.F2
N$271: B.E2 U$5.E2
N$272: B.D2 U$5.D2
N$273: B.R2 U$5.R2
N$274: B.S2 U$5.S2
N$275: B.B2 U$5.B2
N$276: B.T2 U$5.T2
N$277: B.U2 U$5.U2
N$278: B.V2 U$5.V2
N$279: B.A1 U$5.A1
N$280: B.V1 U$5.V1
N$281: B.U1 U$5.U1
N$282: B.T1 U$5.T1
N$283: B.S1 U$5.S1
N$284: B.R1 U$5.R1
N$285: B.P1 U$5.P1
N$286: B.N1 U$5.N1
N$287: B.M1 U$5.M1
N$288: B.L1 U$5.L1
N$289: B.K1 U$5.K1
N$290: B.J1 U$5.J1
N$291: B.H1 U$5.H1
N$292: B.F1 U$5.F1
N$293: B.E1 U$5.E1
N$294: B.D1 U$5.D1
N$295: B.C1 U$5.C1
N$296: B.B1 U$5.B1
N$297: SV27.1 SV27.2 SV28.1
N$298: SV27.3 SV27.4 SV28.3
N$299: SV27.5 SV27.6 SV28.5
N$300: SV27.7 SV27.8 SV28.7
N$301: SV27.9 SV27.10 SV28.9
N$302: SV27.11 SV27.12 SV28.11
N$303: SV27.13 SV27.14 SV28.13
N$304: SV27.15 SV27.16 SV28.15
N$305: SV27.17 SV27.18 SV28.17
N$306: SV27.19 SV27.20 SV28.19
N$307: SV27.21 SV27.22 SV28.21
N$308: SV27.23 SV27.24 SV28.23
N$309: SV27.25 SV27.26 SV28.25
N$310: SV27.27 SV27.28 SV28.27
N$311: SV27.29 SV27.30 SV28.29
N$312: SV27.31 SV27.32 SV28.31
N$313: SV27.33 SV27.34 SV28.33
N$314: SV27.35 SV27.36 SV28.35
N$315: SV27.37 SV27.38 SV28.37
N$316: SV27.39 SV27.40 SV28.39
N$317: SV25.1 SV25.2 SV26.1
N$318: SV25.3 SV25.4 SV26.3
N$319: SV25.5 SV25.6 SV26.5
N$320: SV25.7 SV25.8 SV26.7
N$321: SV25.9 SV25.10 SV26.9
N$322: SV25.11 SV25.12 SV26.11
N$323: SV25.13 SV25.14 SV26.13
N$324: SV25.15 SV25.16 SV26.15
N$325: SV25.17 SV25.18 SV26.17
N$326: SV25.19 SV25.20 SV26.19
N$327: SV25.21 SV25.22 SV26.21
N$328: SV25.23 SV25.24 SV26.23
N$329: SV25.25 SV25.26 SV26.25
N$330: SV25.27 SV25.28 SV26.27
N$331: SV25.29 SV25.30 SV26.29
N$332: SV25.31 SV25.32 SV26.31
N$333: SV25.33 SV25.34 SV26.33
N$334: SV25.35 SV25.36 SV26.35
N$335: SV29.39 SV29.40 SV30.40
N$336: SV29.37 SV29.38 SV30.38
N$337: SV29.35 SV29.36 SV30.36
N$338: SV29.33 SV29.34 SV30.34
N$339: SV29.31 SV29.32 SV30.32
N$340: SV29.29 SV29.30 SV30.30
N$341: SV29.27 SV29.28 SV30.28
N$342: SV29.25 SV29.26 SV30.26
N$343: SV29.23 SV29.24 SV30.24
N$344: SV29.21 SV29.22 SV30.22
N$345: SV29.19 SV29.20 SV30.20
N$346: SV29.17 SV29.18 SV30.18
N$347: SV29.15 SV29.16 SV30.16
N$348: SV29.13 SV29.14 SV30.14
N$349: SV29.11 SV29.12 SV30.12
N$350: SV29.9 SV29.10 SV30.10
N$351: SV29.7 SV29.8 SV30.8
N$352: SV29.5 SV29.6 SV30.6
N$353: SV29.3 SV29.4 SV30.4
N$354: SV29.1 SV29.2 SV30.2
N$355: SV31.35 SV31.36 SV32.36
N$356: SV31.33 SV31.34 SV32.34
N$357: SV31.31 SV31.32 SV32.32
N$358: SV31.29 SV31.30 SV32.30
N$359: SV31.27 SV31.28 SV32.28
N$360: SV31.25 SV31.26 SV32.26
N$361: SV31.23 SV31.24 SV32.24
N$362: SV31.21 SV31.22 SV32.22
N$363: SV31.19 SV31.20 SV32.20
N$364: SV31.17 SV31.18 SV32.18
N$365: SV31.15 SV31.16 SV32.16
N$366: SV31.13 SV31.14 SV32.14
N$367: SV31.11 SV31.12 SV32.12
N$368: SV31.9 SV31.10 SV32.10
N$369: SV31.7 SV31.8 SV32.8
N$370: SV31.5 SV31.6 SV32.6
N$371: SV31.3 SV31.4 SV32.4
N$372: SV31.1 SV31.2 SV32.2
N$373: SV35.1 SV35.2 SV36.1
N$374: SV35.3 SV35.4 SV36.3
N$375: SV35.5 SV35.6 SV36.5
N$376: SV35.7 SV35.8 SV36.7
N$377: SV35.9 SV35.10 SV36.9
N$378: SV35.11 SV35.12 SV36.11
N$379: SV35.13 SV35.14 SV36.13
N$380: SV35.15 SV35.16 SV36.15
N$381: SV35.17 SV35.18 SV36.17
N$382: SV35.19 SV35.20 SV36.19
N$383: SV35.21 SV35.22 SV36.21
N$384: SV35.23 SV35.24 SV36.23
N$385: SV35.25 SV35.26 SV36.25
N$386: SV35.27 SV35.28 SV36.27
N$387: SV35.29 SV35.30 SV36.29
N$388: SV35.31 SV35.32 SV36.31
N$389: SV35.33 SV35.34 SV36.33
N$390: SV35.35 SV35.36 SV36.35
N$391: SV35.37 SV35.38 SV36.37
N$392: SV35.39 SV35.40 SV36.39
N$393: SV33.1 SV33.2 SV34.1
N$394: SV33.3 SV33.4 SV34.3
N$395: SV33.5 SV33.6 SV34.5
N$396: SV33.7 SV33.8 SV34.7
N$397: SV33.9 SV33.10 SV34.9
N$398: SV33.11 SV33.12 SV34.11
N$399: SV33.13 SV33.14 SV34.13
N$400: SV33.15 SV33.16 SV34.15
N$401: SV33.17 SV33.18 SV34.17
N$402: SV33.19 SV33.20 SV34.19
N$403: SV33.21 SV33.22 SV34.21
N$404: SV33.23 SV33.24 SV34.23
N$405: SV33.25 SV33.26 SV34.25
N$406: SV33.27 SV33.28 SV34.27
N$407: SV33.29 SV33.30 SV34.29
N$408: SV33.31 SV33.32 SV34.31
N$409: SV33.33 SV33.34 SV34.33
N$410: SV33.35 SV33.36 SV34.35
N$411: SV37.39 SV37.40 SV38.40
N$412: SV37.37 SV37.38 SV38.38
N$413: SV37.35 SV37.36 SV38.36
N$414: SV37.33 SV37.34 SV38.34
N$415: SV37.31 SV37.32 SV38.32
N$416: SV37.29 SV37.30 SV38.30
N$417: SV37.27 SV37.28 SV38.28
N$418: SV37.25 SV37.26 SV38.26
N$419: SV37.23 SV37.24 SV38.24
N$420: SV37.21 SV37.22 SV38.22
N$421: SV37.19 SV37.20 SV38.20
N$422: SV37.17 SV37.18 SV38.18
N$423: SV37.15 SV37.16 SV38.16
N$424: SV37.13 SV37.14 SV38.14
N$425: SV37.11 SV37.12 SV38.12
N$426: SV37.9 SV37.10 SV38.10
N$427: SV37.7 SV37.8 SV38.8
N$428: SV37.5 SV37.6 SV38.6
N$429: SV37.3 SV37.4 SV38.4
N$430: SV37.1 SV37.2 SV38.2
N$431: SV39.35 SV39.36 SV40.36
N$432: SV39.33 SV39.34 SV40.34
N$433: SV39.31 SV39.32 SV40.32
N$434: SV39.29 SV39.30 SV40.30
N$435: SV39.27 SV39.28 SV40.28
N$436: SV39.25 SV39.26 SV40.26
N$437: SV39.23 SV39.24 SV40.24
N$438: SV39.21 SV39.22 SV40.22
N$439: SV39.19 SV39.20 SV40.20
N$440: SV39.17 SV39.18 SV40.18
N$441: SV39.15 SV39.16 SV40.16
N$442: SV39.13 SV39.14 SV40.14
N$443: SV39.11 SV39.12 SV40.12
N$444: SV39.9 SV39.10 SV40.10
N$445: SV39.7 SV39.8 SV40.8
N$446: SV39.5 SV39.6 SV40.6
N$447: SV39.3 SV39.4 SV40.4
N$448: SV39.1 SV39.2 SV40.2
N$449: SV43.1 SV43.2 SV44.1
N$450: SV43.3 SV43.4 SV44.3
N$451: SV43.5 SV43.6 SV44.5
N$452: SV43.7 SV43.8 SV44.7
N$453: SV43.9 SV43.10 SV44.9
N$454: SV43.11 SV43.12 SV44.11
N$455: SV43.13 SV43.14 SV44.13
N$456: SV43.15 SV43.16 SV44.15
N$457: SV43.17 SV43.18 SV44.17
N$458: SV43.19 SV43.20 SV44.19
N$459: SV43.21 SV43.22 SV44.21
N$460: SV43.23 SV43.24 SV44.23
N$461: SV43.25 SV43.26 SV44.25
N$462: SV43.27 SV43.28 SV44.27
N$463: SV43.29 SV43.30 SV44.29
N$464: SV43.31 SV43.32 SV44.31
N$465: SV43.33 SV43.34 SV44.33
N$466: SV43.35 SV43.36 SV44.35
N$467: SV43.37 SV43.38 SV44.37
N$468: SV43.39 SV43.40 SV44.39
N$469: SV41.1 SV41.2 SV42.1
N$470: SV41.3 SV41.4 SV42.3
N$471: SV41.5 SV41.6 SV42.5
N$472: SV41.7 SV41.8 SV42.7
N$473: SV41.9 SV41.10 SV42.9
N$474: SV41.11 SV41.12 SV42.11
N$475: SV41.13 SV41.14 SV42.13
N$476: SV41.15 SV41.16 SV42.15
N$477: SV41.17 SV41.18 SV42.17
N$478: SV41.19 SV41.20 SV42.19
N$479: SV41.21 SV41.22 SV42.21
N$480: SV41.23 SV41.24 SV42.23
N$481: SV41.25 SV41.26 SV42.25
N$482: SV41.27 SV41.28 SV42.27
N$483: SV41.29 SV41.30 SV42.29
N$484: SV41.31 SV41.32 SV42.31
N$485: SV41.33 SV41.34 SV42.33
N$486: SV41.35 SV41.36 SV42.35
N$487: SV45.39 SV45.40 SV46.40
N$488: SV45.37 SV45.38 SV46.38
N$489: SV45.35 SV45.36 SV46.36
N$490: SV45.33 SV45.34 SV46.34
N$491: SV45.31 SV45.32 SV46.32
N$492: SV45.29 SV45.30 SV46.30
N$493: SV45.27 SV45.28 SV46.28
N$494: SV45.25 SV45.26 SV46.26
N$495: SV45.23 SV45.24 SV46.24
N$496: SV45.21 SV45.22 SV46.22
N$497: SV45.19 SV45.20 SV46.20
N$498: SV45.17 SV45.18 SV46.18
N$499: SV45.15 SV45.16 SV46.16
N$500: SV45.13 SV45.14 SV46.14
N$501: SV45.11 SV45.12 SV46.12
N$502: SV45.9 SV45.10 SV46.10
N$503: SV45.7 SV45.8 SV46.8
N$504: SV45.5 SV45.6 SV46.6
N$505: SV45.3 SV45.4 SV46.4
N$506: SV45.1 SV45.2 SV46.2
N$507: SV47.35 SV47.36 SV48.36
N$508: SV47.33 SV47.34 SV48.34
N$509: SV47.31 SV47.32 SV48.32
N$510: SV47.29 SV47.30 SV48.30
N$511: SV47.27 SV47.28 SV48.28
N$512: SV47.25 SV47.26 SV48.26
N$513: SV47.23 SV47.24 SV48.24
N$514: SV47.21 SV47.22 SV48.22
N$515: SV47.19 SV47.20 SV48.20
N$516: SV47.17 SV47.18 SV48.18
N$517: SV47.15 SV47.16 SV48.16
N$518: SV47.13 SV47.14 SV48.14
N$519: SV47.11 SV47.12 SV48.12
N$520: SV47.9 SV47.10 SV48.10
N$521: SV47.7 SV47.8 SV48.8
N$522: SV47.5 SV47.6 SV48.6
N$523: SV47.3 SV47.4 SV48.4
N$524: SV47.1 SV47.2 SV48.2
N$525: SV66.2 SV66.4 SV66.6
N$526: SV66.1 SV66.3 SV66.5
N$527: SV67.2 SV67.4 SV67.6
N$528: SV67.1 SV67.3 SV67.5
N$529: SV68.2 SV68.4 SV68.6
N$530: SV68.1 SV68.3 SV68.5
N$531: SV49.2 SV49.4 SV49.6
N$532: SV49.1 SV49.3 SV49.5
N$533: SV50.2 SV50.4 SV50.6
N$534: SV50.1 SV50.3 SV50.5
N$535: SV51.2 SV51.4 SV51.6
N$536: SV51.1 SV51.3 SV51.5
N$537: SV52.1 SV52.3 SV52.5
N$538: SV52.2 SV52.4 SV52.6
N$539: SV53.2 SV53.4 SV53.6
N$540: SV53.1 SV53.3 SV53.5
N$541: SV54.2 SV54.4 SV54.6
N$542: SV54.1 SV54.3 SV54.5
N$543: SV55.2 SV55.4 SV55.6
N$544: SV55.1 SV55.3 SV55.5
N$545: SV56.2 SV56.4 SV56.6
N$546: SV56.1 SV56.3 SV56.5
N$547: SV57.2 SV57.4 SV57.6
N$548: SV57.1 SV57.3 SV57.5
N$549: SV58.2 SV58.4 SV58.6
N$550: SV58.1 SV58.3 SV58.5
N$551: SV59.2 SV59.4 SV59.6
N$552: SV59.1 SV59.3 SV59.5
N$553: SV60.2 SV60.4 SV60.6
N$554: SV60.1 SV60.3 SV60.5
N$555: SV61.2 SV61.4 SV61.6
N$556: SV61.1 SV61.3 SV61.5
N$557: SV62.2 SV62.4 SV62.6
N$558: SV62.1 SV62.3 SV62.5
N$559: SV63.2 SV63.4 SV63.6
N$560: SV63.1 SV63.3 SV63.5
N$561: SV64.2 SV64.4 SV64.6
N$562: SV64.1 SV64.3 SV64.5
N$563: A1.K2 U$1.K2
N$564: A1.J2 U$1.J2
N$565: A1.H2 U$1.H2
N$566: A1.L2 U$1.L2
N$567: A1.M2 U$1.M2
N$568: A1.N2 U$1.N2
N$569: A1.P2 U$1.P2
N$570: A1.F2 U$1.F2
N$571: A1.E2 U$1.E2
N$572: A1.D2 U$1.D2
N$573: A1.R2 U$1.R2
N$574: A1.S2 U$1.S2
N$575: A1.B2 U$1.B2
N$576: A1.T2 U$1.T2
N$577: A1.U2 U$1.U2
N$578: A1.V2 U$1.V2
N$579: A1.A1 U$1.A1
N$580: A1.V1 U$1.V1
N$581: A1.U1 U$1.U1
N$582: A1.T1 U$1.T1
N$583: A1.S1 U$1.S1
N$584: A1.R1 U$1.R1
N$585: A1.P1 U$1.P1
N$586: A1.N1 U$1.N1
N$587: A1.M1 U$1.M1
N$588: A1.L1 U$1.L1
N$589: A1.K1 U$1.K1
N$590: A1.J1 U$1.J1
N$591: A1.H1 U$1.H1
N$592: A1.F1 U$1.F1
N$593: A1.E1 U$1.E1
N$594: A1.D1 U$1.D1
N$595: A1.C1 U$1.C1
N$596: A1.B1 U$1.B1
N$597: SV70.1 SV70.2 SV71.1
N$598: SV70.3 SV70.4 SV71.3
N$599: SV70.5 SV70.6 SV71.5
N$600: SV70.7 SV70.8 SV71.7
N$601: SV70.9 SV70.10 SV71.9
N$602: SV70.11 SV70.12 SV71.11
N$603: SV70.13 SV70.14 SV71.13
N$604: SV70.15 SV70.16 SV71.15
N$605: SV70.17 SV70.18 SV71.17
N$606: SV70.19 SV70.20 SV71.19
N$607: SV70.21 SV70.22 SV71.21
N$608: SV70.23 SV70.24 SV71.23
N$609: SV70.25 SV70.26 SV71.25
N$610: SV70.27 SV70.28 SV71.27
N$611: SV70.29 SV70.30 SV71.29
N$612: SV70.31 SV70.32 SV71.31
N$613: SV70.33 SV70.34 SV71.33
N$614: SV70.35 SV70.36 SV71.35
N$615: SV70.37 SV70.38 SV71.37
N$616: SV70.39 SV70.40 SV71.39
N$617: SV65.1 SV65.2 SV69.1
N$618: SV65.3 SV65.4 SV69.3
N$619: SV65.5 SV65.6 SV69.5
N$620: SV65.7 SV65.8 SV69.7
N$621: SV65.9 SV65.10 SV69.9
N$622: SV65.11 SV65.12 SV69.11
N$623: SV65.13 SV65.14 SV69.13
N$624: SV65.15 SV65.16 SV69.15
N$625: SV65.17 SV65.18 SV69.17
N$626: SV65.19 SV65.20 SV69.19
N$627: SV65.21 SV65.22 SV69.21
N$628: SV65.23 SV65.24 SV69.23
N$629: SV65.25 SV65.26 SV69.25
N$630: SV65.27 SV65.28 SV69.27
N$631: SV65.29 SV65.30 SV69.29
N$632: SV65.31 SV65.32 SV69.31
N$633: SV65.33 SV65.34 SV69.33
N$634: SV65.35 SV65.36 SV69.35
N$635: SV72.39 SV72.40 SV73.40
N$636: SV72.37 SV72.38 SV73.38
N$637: SV72.35 SV72.36 SV73.36
N$638: SV72.33 SV72.34 SV73.34
N$639: SV72.31 SV72.32 SV73.32
N$640: SV72.29 SV72.30 SV73.30
N$641: SV72.27 SV72.28 SV73.28
N$642: SV72.25 SV72.26 SV73.26
N$643: SV72.23 SV72.24 SV73.24
N$644: SV72.21 SV72.22 SV73.22
N$645: SV72.19 SV72.20 SV73.20
N$646: SV72.17 SV72.18 SV73.18
N$647: SV72.15 SV72.16 SV73.16
N$648: SV72.13 SV72.14 SV73.14
N$649: SV72.11 SV72.12 SV73.12
N$650: SV72.9 SV72.10 SV73.10
N$651: SV72.7 SV72.8 SV73.8
N$652: SV72.5 SV72.6 SV73.6
N$653: SV72.3 SV72.4 SV73.4
N$654: SV72.1 SV72.2 SV73.2
N$655: SV74.35 SV74.36 SV75.36
N$656: SV74.33 SV74.34 SV75.34
N$657: SV74.31 SV74.32 SV75.32
N$658: SV74.29 SV74.30 SV75.30
N$659: SV74.27 SV74.28 SV75.28
N$660: SV74.25 SV74.26 SV75.26
N$661: SV74.23 SV74.24 SV75.24
N$662: SV74.21 SV74.22 SV75.22
N$663: SV74.19 SV74.20 SV75.20
N$664: SV74.17 SV74.18 SV75.18
N$665: SV74.15 SV74.16 SV75.16
N$666: SV74.13 SV74.14 SV75.14
N$667: SV74.11 SV74.12 SV75.12
N$668: SV74.9 SV74.10 SV75.10
N$669: SV74.7 SV74.8 SV75.8
N$670: SV74.5 SV74.6 SV75.6
N$671: SV74.3 SV74.4 SV75.4
N$672: SV74.1 SV74.2 SV75.2
N$673: SV78.1 SV78.2 SV79.1
N$674: SV78.3 SV78.4 SV79.3
N$675: SV78.5 SV78.6 SV79.5
N$676: SV78.7 SV78.8 SV79.7
N$677: SV78.9 SV78.10 SV79.9
N$678: SV78.11 SV78.12 SV79.11
N$679: SV78.13 SV78.14 SV79.13
N$680: SV78.15 SV78.16 SV79.15
N$681: SV78.17 SV78.18 SV79.17
N$682: SV78.19 SV78.20 SV79.19
N$683: SV78.21 SV78.22 SV79.21
N$684: SV78.23 SV78.24 SV79.23
N$685: SV78.25 SV78.26 SV79.25
N$686: SV78.27 SV78.28 SV79.27
N$687: SV78.29 SV78.30 SV79.29
N$688: SV78.31 SV78.32 SV79.31
N$689: SV78.33 SV78.34 SV79.33
N$690: SV78.35 SV78.36 SV79.35
N$691: SV78.37 SV78.38 SV79.37
N$692: SV78.39 SV78.40 SV79.39
N$693: SV76.1 SV76.2 SV77.1
N$694: SV76.3 SV76.4 SV77.3
N$695: SV76.5 SV76.6 SV77.5
N$696: SV76.7 SV76.8 SV77.7
N$697: SV76.9 SV76.10 SV77.9
N$698: SV76.11 SV76.12 SV77.11
N$699: SV76.13 SV76.14 SV77.13
N$700: SV76.15 SV76.16 SV77.15
N$701: SV76.17 SV76.18 SV77.17
N$702: SV76.19 SV76.20 SV77.19
N$703: SV76.21 SV76.22 SV77.21
N$704: SV76.23 SV76.24 SV77.23
N$705: SV76.25 SV76.26 SV77.25
N$706: SV76.27 SV76.28 SV77.27
N$707: SV76.29 SV76.30 SV77.29
N$708: SV76.31 SV76.32 SV77.31
N$709: SV76.33 SV76.34 SV77.33
N$710: SV76.35 SV76.36 SV77.35
N$711: SV80.39 SV80.40 SV81.40
N$712: SV80.37 SV80.38 SV81.38
N$713: SV80.35 SV80.36 SV81.36
N$714: SV80.33 SV80.34 SV81.34
N$715: SV80.31 SV80.32 SV81.32
N$716: SV80.29 SV80.30 SV81.30
N$717: SV80.27 SV80.28 SV81.28
N$718: SV80.25 SV80.26 SV81.26
N$719: SV80.23 SV80.24 SV81.24
N$720: SV80.21 SV80.22 SV81.22
N$721: SV80.19 SV80.20 SV81.20
N$722: SV80.17 SV80.18 SV81.18
N$723: SV80.15 SV80.16 SV81.16
N$724: SV80.13 SV80.14 SV81.14
N$725: SV80.11 SV80.12 SV81.12
N$726: SV80.9 SV80.10 SV81.10
N$727: SV80.7 SV80.8 SV81.8
N$728: SV80.5 SV80.6 SV81.6
N$729: SV80.3 SV80.4 SV81.4
N$730: SV80.1 SV80.2 SV81.2
N$731: SV82.35 SV82.36 SV83.36
N$732: SV82.33 SV82.34 SV83.34
N$733: SV82.31 SV82.32 SV83.32
N$734: SV82.29 SV82.30 SV83.30
N$735: SV82.27 SV82.28 SV83.28
N$736: SV82.25 SV82.26 SV83.26
N$737: SV82.23 SV82.24 SV83.24
N$738: SV82.21 SV82.22 SV83.22
N$739: SV82.19 SV82.20 SV83.20
N$740: SV82.17 SV82.18 SV83.18
N$741: SV82.15 SV82.16 SV83.16
N$742: SV82.13 SV82.14 SV83.14
N$743: SV82.11 SV82.12 SV83.12
N$744: SV82.9 SV82.10 SV83.10
N$745: SV82.7 SV82.8 SV83.8
N$746: SV82.5 SV82.6 SV83.6
N$747: SV82.3 SV82.4 SV83.4
N$748: SV82.1 SV82.2 SV83.2
N$749: SV86.1 SV86.2 SV87.1
N$750: SV86.3 SV86.4 SV87.3
N$751: SV86.5 SV86.6 SV87.5
N$752: SV86.7 SV86.8 SV87.7
N$753: SV86.9 SV86.10 SV87.9
N$754: SV86.11 SV86.12 SV87.11
N$755: SV86.13 SV86.14 SV87.13
N$756: SV86.15 SV86.16 SV87.15
N$757: SV86.17 SV86.18 SV87.17
N$758: SV86.19 SV86.20 SV87.19
N$759: SV86.21 SV86.22 SV87.21
N$760: SV86.23 SV86.24 SV87.23
N$761: SV86.25 SV86.26 SV87.25
N$762: SV86.27 SV86.28 SV87.27
N$763: SV86.29 SV86.30 SV87.29
N$764: SV86.31 SV86.32 SV87.31
N$765: SV86.33 SV86.34 SV87.33
N$766: SV86.35 SV86.36 SV87.35
N$767: SV86.37 SV86.38 SV87.37
N$768: SV86.39 SV86.40 SV87.39
N$769: SV84.1 SV84.2 SV85.1
N$770: SV84.3 SV84.4 SV85.3
N$771: SV84.5 SV84.6 SV85.5
N$772: SV84.7 SV84.8 SV85.7
N$773: SV84.9 SV84.10 SV85.9
N$774: SV84.11 SV84.12 SV85.11
N$775: SV84.13 SV84.14 SV85.13
N$776: SV84.15 SV84.16 SV85.15
N$777: SV84.17 SV84.18 SV85.17
N$778: SV84.19 SV84.20 SV85.19
N$779: SV84.21 SV84.22 SV85.21
N$780: SV84.23 SV84.24 SV85.23
N$781: SV84.25 SV84.26 SV85.25
N$782: SV84.27 SV84.28 SV85.27
N$783: SV84.29 SV84.30 SV85.29
N$784: SV84.31 SV84.32 SV85.31
N$785: SV84.33 SV84.34 SV85.33
N$786: SV84.35 SV84.36 SV85.35
N$787: SV88.39 SV88.40 SV89.40
N$788: SV88.37 SV88.38 SV89.38
N$789: SV88.35 SV88.36 SV89.36
N$790: SV88.33 SV88.34 SV89.34
N$791: SV88.31 SV88.32 SV89.32
N$792: SV88.29 SV88.30 SV89.30
N$793: SV88.27 SV88.28 SV89.28
N$794: SV88.25 SV88.26 SV89.26
N$795: SV88.23 SV88.24 SV89.24
N$796: SV88.21 SV88.22 SV89.22
N$797: SV88.19 SV88.20 SV89.20
N$798: SV88.17 SV88.18 SV89.18
N$799: SV88.15 SV88.16 SV89.16
N$800: SV88.13 SV88.14 SV89.14
N$801: SV88.11 SV88.12 SV89.12
N$802: SV88.9 SV88.10 SV89.10
N$803: SV88.7 SV88.8 SV89.8
N$804: SV88.5 SV88.6 SV89.6
N$805: SV88.3 SV88.4 SV89.4
N$806: SV88.1 SV88.2 SV89.2
N$807: SV90.35 SV90.36 SV91.36
N$808: SV90.33 SV90.34 SV91.34
N$809: SV90.31 SV90.32 SV91.32
N$810: SV90.29 SV90.30 SV91.30
N$811: SV90.27 SV90.28 SV91.28
N$812: SV90.25 SV90.26 SV91.26
N$813: SV90.23 SV90.24 SV91.24
N$814: SV90.21 SV90.22 SV91.22
N$815: SV90.19 SV90.20 SV91.20
N$816: SV90.17 SV90.18 SV91.18
N$817: SV90.15 SV90.16 SV91.16
N$818: SV90.13 SV90.14 SV91.14
N$819: SV90.11 SV90.12 SV91.12
N$820: SV90.9 SV90.10 SV91.10
N$821: SV90.7 SV90.8 SV91.8
N$822: SV90.5 SV90.6 SV91.6
N$823: SV90.3 SV90.4 SV91.4
N$824: SV90.1 SV90.2 SV91.2
N$825: B1.K2 U$6.K2
N$826: B1.J2 U$6.J2
N$827: B1.H2 U$6.H2
N$828: B1.L2 U$6.L2
N$829: B1.M2 U$6.M2
N$830: B1.N2 U$6.N2
N$831: B1.P2 U$6.P2
N$832: B1.F2 U$6.F2
N$833: B1.E2 U$6.E2
N$834: B1.D2 U$6.D2
N$835: B1.R2 U$6.R2
N$836: B1.S2 U$6.S2
N$837: B1.B2 U$6.B2
N$838: B1.T2 U$6.T2
N$839: B1.U2 U$6.U2
N$840: B1.V2 U$6.V2
N$841: B1.A1 U$6.A1
N$842: B1.V1 U$6.V1
N$843: B1.U1 U$6.U1
N$844: B1.T1 U$6.T1
N$845: B1.S1 U$6.S1
N$846: B1.R1 U$6.R1
N$847: B1.P1 U$6.P1
N$848: B1.N1 U$6.N1
N$849: B1.M1 U$6.M1
N$850: B1.L1 U$6.L1
N$851: B1.K1 U$6.K1
N$852: B1.J1 U$6.J1
N$853: B1.H1 U$6.H1
N$854: B1.F1 U$6.F1
N$855: B1.E1 U$6.E1
N$856: B1.D1 U$6.D1
N$857: B1.C1 U$6.C1
N$858: B1.B1 U$6.B1
N$859: SV94.1 SV94.2 SV95.1
N$860: SV94.3 SV94.4 SV95.3
N$861: SV94.5 SV94.6 SV95.5
N$862: SV94.7 SV94.8 SV95.7
N$863: SV94.9 SV94.10 SV95.9
N$864: SV94.11 SV94.12 SV95.11
N$865: SV94.13 SV94.14 SV95.13
N$866: SV94.15 SV94.16 SV95.15
N$867: SV94.17 SV94.18 SV95.17
N$868: SV94.19 SV94.20 SV95.19
N$869: SV94.21 SV94.22 SV95.21
N$870: SV94.23 SV94.24 SV95.23
N$871: SV94.25 SV94.26 SV95.25
N$872: SV94.27 SV94.28 SV95.27
N$873: SV94.29 SV94.30 SV95.29
N$874: SV94.31 SV94.32 SV95.31
N$875: SV94.33 SV94.34 SV95.33
N$876: SV94.35 SV94.36 SV95.35
N$877: SV94.37 SV94.38 SV95.37
N$878: SV94.39 SV94.40 SV95.39
N$879: SV92.1 SV92.2 SV93.1
N$880: SV92.3 SV92.4 SV93.3
N$881: SV92.5 SV92.6 SV93.5
N$882: SV92.7 SV92.8 SV93.7
N$883: SV92.9 SV92.10 SV93.9
N$884: SV92.11 SV92.12 SV93.11
N$885: SV92.13 SV92.14 SV93.13
N$886: SV92.15 SV92.16 SV93.15
N$887: SV92.17 SV92.18 SV93.17
N$888: SV92.19 SV92.20 SV93.19
N$889: SV92.21 SV92.22 SV93.21
N$890: SV92.23 SV92.24 SV93.23
N$891: SV92.25 SV92.26 SV93.25
N$892: SV92.27 SV92.28 SV93.27
N$893: SV92.29 SV92.30 SV93.29
N$894: SV92.31 SV92.32 SV93.31
N$895: SV92.33 SV92.34 SV93.33
N$896: SV92.35 SV92.36 SV93.35
N$897: SV96.39 SV96.40 SV97.40
N$898: SV96.37 SV96.38 SV97.38
N$899: SV96.35 SV96.36 SV97.36
N$900: SV96.33 SV96.34 SV97.34
N$901: SV96.31 SV96.32 SV97.32
N$902: SV96.29 SV96.30 SV97.30
N$903: SV96.27 SV96.28 SV97.28
N$904: SV96.25 SV96.26 SV97.26
N$905: SV96.23 SV96.24 SV97.24
N$906: SV96.21 SV96.22 SV97.22
N$907: SV96.19 SV96.20 SV97.20
N$908: SV96.17 SV96.18 SV97.18
N$909: SV96.15 SV96.16 SV97.16
N$910: SV96.13 SV96.14 SV97.14
N$911: SV96.11 SV96.12 SV97.12
N$912: SV96.9 SV96.10 SV97.10
N$913: SV96.7 SV96.8 SV97.8
N$914: SV96.5 SV96.6 SV97.6
N$915: SV96.3 SV96.4 SV97.4
N$916: SV96.1 SV96.2 SV97.2
N$917: SV98.35 SV98.36 SV99.36
N$918: SV98.33 SV98.34 SV99.34
N$919: SV98.31 SV98.32 SV99.32
N$920: SV98.29 SV98.30 SV99.30
N$921: SV98.27 SV98.28 SV99.28
N$922: SV98.25 SV98.26 SV99.26
N$923: SV98.23 SV98.24 SV99.24
N$924: SV98.21 SV98.22 SV99.22
N$925: SV98.19 SV98.20 SV99.20
N$926: SV98.17 SV98.18 SV99.18
N$927: SV98.15 SV98.16 SV99.16
N$928: SV98.13 SV98.14 SV99.14
N$929: SV98.11 SV98.12 SV99.12
N$930: SV98.9 SV98.10 SV99.10
N$931: SV98.7 SV98.8 SV99.8
N$932: SV98.5 SV98.6 SV99.6
N$933: SV98.3 SV98.4 SV99.4
N$934: SV98.1 SV98.2 SV99.2
N$935: SV102.1 SV102.2 SV103.1
N$936: SV102.3 SV102.4 SV103.3
N$937: SV102.5 SV102.6 SV103.5
N$938: SV102.7 SV102.8 SV103.7
N$939: SV102.9 SV102.10 SV103.9
N$940: SV102.11 SV102.12 SV103.11
N$941: SV102.13 SV102.14 SV103.13
N$942: SV102.15 SV102.16 SV103.15
N$943: SV102.17 SV102.18 SV103.17
N$944: SV102.19 SV102.20 SV103.19
N$945: SV102.21 SV102.22 SV103.21
N$946: SV102.23 SV102.24 SV103.23
N$947: SV102.25 SV102.26 SV103.25
N$948: SV102.27 SV102.28 SV103.27
N$949: SV102.29 SV102.30 SV103.29
N$950: SV102.31 SV102.32 SV103.31
N$951: SV102.33 SV102.34 SV103.33
N$952: SV102.35 SV102.36 SV103.35
N$953: SV102.37 SV102.38 SV103.37
N$954: SV102.39 SV102.40 SV103.39
N$955: SV100.1 SV100.2 SV101.1
N$956: SV100.3 SV100.4 SV101.3
N$957: SV100.5 SV100.6 SV101.5
N$958: SV100.7 SV100.8 SV101.7
N$959: SV100.9 SV100.10 SV101.9
N$960: SV100.11 SV100.12 SV101.11
N$961: SV100.13 SV100.14 SV101.13
N$962: SV100.15 SV100.16 SV101.15
N$963: SV100.17 SV100.18 SV101.17
N$964: SV100.19 SV100.20 SV101.19
N$965: SV100.21 SV100.22 SV101.21
N$966: SV100.23 SV100.24 SV101.23
N$967: SV100.25 SV100.26 SV101.25
N$968: SV100.27 SV100.28 SV101.27
N$969: SV100.29 SV100.30 SV101.29
N$970: SV100.31 SV100.32 SV101.31
N$971: SV100.33 SV100.34 SV101.33
N$972: SV100.35 SV100.36 SV101.35
N$973: SV104.39 SV104.40 SV105.40
N$974: SV104.37 SV104.38 SV105.38
N$975: SV104.35 SV104.36 SV105.36
N$976: SV104.33 SV104.34 SV105.34
N$977: SV104.31 SV104.32 SV105.32
N$978: SV104.29 SV104.30 SV105.30
N$979: SV104.27 SV104.28 SV105.28
N$980: SV104.25 SV104.26 SV105.26
N$981: SV104.23 SV104.24 SV105.24
N$982: SV104.21 SV104.22 SV105.22
N$983: SV104.19 SV104.20 SV105.20
N$984: SV104.17 SV104.18 SV105.18
N$985: SV104.15 SV104.16 SV105.16
N$986: SV104.13 SV104.14 SV105.14
N$987: SV104.11 SV104.12 SV105.12
N$988: SV104.9 SV104.10 SV105.10
N$989: SV104.7 SV104.8 SV105.8
N$990: SV104.5 SV104.6 SV105.6
N$991: SV104.3 SV104.4 SV105.4
N$992: SV104.1 SV104.2 SV105.2
N$993: SV106.35 SV106.36 SV107.36
N$994: SV106.33 SV106.34 SV107.34
N$995: SV106.31 SV106.32 SV107.32
N$996: SV106.29 SV106.30 SV107.30
N$997: SV106.27 SV106.28 SV107.28
N$998: SV106.25 SV106.26 SV107.26
N$999: SV106.23 SV106.24 SV107.24
N$1000: SV106.21 SV106.22 SV107.22
N$1001: SV106.19 SV106.20 SV107.20
N$1002: SV106.17 SV106.18 SV107.18
N$1003: SV106.15 SV106.16 SV107.16
N$1004: SV106.13 SV106.14 SV107.14
N$1005: SV106.11 SV106.12 SV107.12
N$1006: SV106.9 SV106.10 SV107.10
N$1007: SV106.7 SV106.8 SV107.8
N$1008: SV106.5 SV106.6 SV107.6
N$1009: SV106.3 SV106.4 SV107.4
N$1010: SV106.1 SV106.2 SV107.2
N$1011: SV110.1 SV110.2 SV111.1
N$1012: SV110.3 SV110.4 SV111.3
N$1013: SV110.5 SV110.6 SV111.5
N$1014: SV110.7 SV110.8 SV111.7
N$1015: SV110.9 SV110.10 SV111.9
N$1016: SV110.11 SV110.12 SV111.11
N$1017: SV110.13 SV110.14 SV111.13
N$1018: SV110.15 SV110.16 SV111.15
N$1019: SV110.17 SV110.18 SV111.17
N$1020: SV110.19 SV110.20 SV111.19
N$1021: SV110.21 SV110.22 SV111.21
N$1022: SV110.23 SV110.24 SV111.23
N$1023: SV110.25 SV110.26 SV111.25
N$1024: SV110.27 SV110.28 SV111.27
N$1025: SV110.29 SV110.30 SV111.29
N$1026: SV110.31 SV110.32 SV111.31
N$1027: SV110.33 SV110.34 SV111.33
N$1028: SV110.35 SV110.36 SV111.35
N$1029: SV110.37 SV110.38 SV111.37
N$1030: SV110.39 SV110.40 SV111.39
N$1031: SV108.1 SV108.2 SV109.1
N$1032: SV108.3 SV108.4 SV109.3
N$1033: SV108.5 SV108.6 SV109.5
N$1034: SV108.7 SV108.8 SV109.7
N$1035: SV108.9 SV108.10 SV109.9
N$1036: SV108.11 SV108.12 SV109.11
N$1037: SV108.13 SV108.14 SV109.13
N$1038: SV108.15 SV108.16 SV109.15
N$1039: SV108.17 SV108.18 SV109.17
N$1040: SV108.19 SV108.20 SV109.19
N$1041: SV108.21 SV108.22 SV109.21
N$1042: SV108.23 SV108.24 SV109.23
N$1043: SV108.25 SV108.26 SV109.25
N$1044: SV108.27 SV108.28 SV109.27
N$1045: SV108.29 SV108.30 SV109.29
N$1046: SV108.31 SV108.32 SV109.31
N$1047: SV108.33 SV108.34 SV109.33
N$1048: SV108.35 SV108.36 SV109.35
N$1049: SV112.39 SV112.40 SV113.40
N$1050: SV112.37 SV112.38 SV113.38
N$1051: SV112.35 SV112.36 SV113.36
N$1052: SV112.33 SV112.34 SV113.34
N$1053: SV112.31 SV112.32 SV113.32
N$1054: SV112.29 SV112.30 SV113.30
N$1055: SV112.27 SV112.28 SV113.28
N$1056: SV112.25 SV112.26 SV113.26
N$1057: SV112.23 SV112.24 SV113.24
N$1058: SV112.21 SV112.22 SV113.22
N$1059: SV112.19 SV112.20 SV113.20
N$1060: SV112.17 SV112.18 SV113.18
N$1061: SV112.15 SV112.16 SV113.16
N$1062: SV112.13 SV112.14 SV113.14
N$1063: SV112.11 SV112.12 SV113.12
N$1064: SV112.9 SV112.10 SV113.10
N$1065: SV112.7 SV112.8 SV113.8
N$1066: SV112.5 SV112.6 SV113.6
N$1067: SV112.3 SV112.4 SV113.4
N$1068: SV112.1 SV112.2 SV113.2
N$1069: SV114.35 SV114.36 SV115.36
N$1070: SV114.33 SV114.34 SV115.34
N$1071: SV114.31 SV114.32 SV115.32
N$1072: SV114.29 SV114.30 SV115.30
N$1073: SV114.27 SV114.28 SV115.28
N$1074: SV114.25 SV114.26 SV115.26
N$1075: SV114.23 SV114.24 SV115.24
N$1076: SV114.21 SV114.22 SV115.22
N$1077: SV114.19 SV114.20 SV115.20
N$1078: SV114.17 SV114.18 SV115.18
N$1079: SV114.15 SV114.16 SV115.16
N$1080: SV114.13 SV114.14 SV115.14
N$1081: SV114.11 SV114.12 SV115.12
N$1082: SV114.9 SV114.10 SV115.10
N$1083: SV114.7 SV114.8 SV115.8
N$1084: SV114.5 SV114.6 SV115.6
N$1085: SV114.3 SV114.4 SV115.4
N$1086: SV114.1 SV114.2 SV115.2
N$1087: SV132.2 SV132.4 SV132.6
N$1088: SV132.1 SV132.3 SV132.5
N$1089: SV133.2 SV133.4 SV133.6
N$1090: SV133.1 SV133.3 SV133.5
N$1091: SV134.2 SV134.4 SV134.6
N$1092: SV134.1 SV134.3 SV134.5
N$1093: SV116.2 SV116.4 SV116.6
N$1094: SV116.1 SV116.3 SV116.5
N$1095: SV117.2 SV117.4 SV117.6
N$1096: SV117.1 SV117.3 SV117.5
N$1097: SV118.2 SV118.4 SV118.6
N$1098: SV118.1 SV118.3 SV118.5
N$1099: SV119.1 SV119.3 SV119.5
N$1100: SV119.2 SV119.4 SV119.6
N$1101: SV120.2 SV120.4 SV120.6
N$1102: SV120.1 SV120.3 SV120.5
N$1103: SV121.2 SV121.4 SV121.6
N$1104: SV121.1 SV121.3 SV121.5
N$1105: SV122.2 SV122.4 SV122.6
N$1106: SV122.1 SV122.3 SV122.5
N$1107: SV123.2 SV123.4 SV123.6
N$1108: SV123.1 SV123.3 SV123.5
N$1109: SV124.2 SV124.4 SV124.6
N$1110: SV124.1 SV124.3 SV124.5
N$1111: SV125.2 SV125.4 SV125.6
N$1112: SV125.1 SV125.3 SV125.5
N$1113: SV126.2 SV126.4 SV126.6
N$1114: SV126.1 SV126.3 SV126.5
N$1115: SV127.2 SV127.4 SV127.6
N$1116: SV127.1 SV127.3 SV127.5
N$1117: SV128.2 SV128.4 SV128.6
N$1118: SV128.1 SV128.3 SV128.5
N$1119: SV129.2 SV129.4 SV129.6
N$1120: SV129.1 SV129.3 SV129.5
N$1121: SV130.2 SV130.4 SV130.6
N$1122: SV130.1 SV130.3 SV130.5
N$1123: SV131.2 SV131.4 SV131.6
N$1124: SV131.1 SV131.3 SV131.5
N$1125: SV137.1 SV137.2 SV138.1
N$1126: SV137.3 SV137.4 SV138.3
N$1127: SV137.5 SV137.6 SV138.5
N$1128: SV137.7 SV137.8 SV138.7
N$1129: SV137.9 SV137.10 SV138.9
N$1130: SV137.11 SV137.12 SV138.11
N$1131: SV137.13 SV137.14 SV138.13
N$1132: SV137.15 SV137.16 SV138.15
N$1133: SV137.17 SV137.18 SV138.17
N$1134: SV137.19 SV137.20 SV138.19
N$1135: SV137.21 SV137.22 SV138.21
N$1136: SV137.23 SV137.24 SV138.23
N$1137: SV137.25 SV137.26 SV138.25
N$1138: SV137.27 SV137.28 SV138.27
N$1139: SV137.29 SV137.30 SV138.29
N$1140: SV137.31 SV137.32 SV138.31
N$1141: SV137.33 SV137.34 SV138.33
N$1142: SV137.35 SV137.36 SV138.35
N$1143: SV137.37 SV137.38 SV138.37
N$1144: SV137.39 SV137.40 SV138.39
N$1145: SV135.1 SV135.2 SV136.1
N$1146: SV135.3 SV135.4 SV136.3
N$1147: SV135.5 SV135.6 SV136.5
N$1148: SV135.7 SV135.8 SV136.7
N$1149: SV135.9 SV135.10 SV136.9
N$1150: SV135.11 SV135.12 SV136.11
N$1151: SV135.13 SV135.14 SV136.13
N$1152: SV135.15 SV135.16 SV136.15
N$1153: SV135.17 SV135.18 SV136.17
N$1154: SV135.19 SV135.20 SV136.19
N$1155: SV135.21 SV135.22 SV136.21
N$1156: SV135.23 SV135.24 SV136.23
N$1157: SV143.1 SV143.2 SV144.1
N$1158: SV143.3 SV143.4 SV144.3
N$1159: SV143.5 SV143.6 SV144.5
N$1160: SV143.7 SV143.8 SV144.7
N$1161: SV143.9 SV143.10 SV144.9
N$1162: SV143.11 SV143.12 SV144.11
N$1163: SV139.39 SV139.40 SV140.40
N$1164: SV139.37 SV139.38 SV140.38
N$1165: SV139.35 SV139.36 SV140.36
N$1166: SV139.33 SV139.34 SV140.34
N$1167: SV139.31 SV139.32 SV140.32
N$1168: SV139.29 SV139.30 SV140.30
N$1169: SV139.27 SV139.28 SV140.28
N$1170: SV139.25 SV139.26 SV140.26
N$1171: SV139.23 SV139.24 SV140.24
N$1172: SV139.21 SV139.22 SV140.22
N$1173: SV139.19 SV139.20 SV140.20
N$1174: SV139.17 SV139.18 SV140.18
N$1175: SV139.15 SV139.16 SV140.16
N$1176: SV139.13 SV139.14 SV140.14
N$1177: SV139.11 SV139.12 SV140.12
N$1178: SV139.9 SV139.10 SV140.10
N$1179: SV139.7 SV139.8 SV140.8
N$1180: SV139.5 SV139.6 SV140.6
N$1181: SV139.3 SV139.4 SV140.4
N$1182: SV139.1 SV139.2 SV140.2
N$1183: SV141.23 SV141.24 SV142.24
N$1184: SV141.21 SV141.22 SV142.22
N$1185: SV141.19 SV141.20 SV142.20
N$1186: SV141.17 SV141.18 SV142.18
N$1187: SV141.15 SV141.16 SV142.16
N$1188: SV141.13 SV141.14 SV142.14
N$1189: SV141.11 SV141.12 SV142.12
N$1190: SV141.9 SV141.10 SV142.10
N$1191: SV141.7 SV141.8 SV142.8
N$1192: SV141.5 SV141.6 SV142.6
N$1193: SV141.3 SV141.4 SV142.4
N$1194: SV141.1 SV141.2 SV142.2
N$1195: SV143.13 SV143.14 SV144.13
N$1196: SV143.15 SV143.16 SV144.15
N$1197: SV143.17 SV143.18 SV144.17
N$1198: SV143.19 SV143.20 SV144.19
N$1199: SV143.21 SV143.22 SV144.21
N$1200: SV143.23 SV143.24 SV144.23
N$1201: SV143.25 SV143.26 SV144.25
N$1202: SV143.27 SV143.28 SV144.27
N$1203: SV143.29 SV143.30 SV144.29
N$1204: SV143.31 SV143.32 SV144.31
N$1205: SV143.33 SV143.34 SV144.33
N$1206: SV143.35 SV143.36 SV144.35
N$1207: SV143.37 SV143.38 SV144.37
N$1208: SV143.39 SV143.40 SV144.39
N$1209: SV149.1 SV149.2 SV150.1
N$1210: SV149.3 SV149.4 SV150.3
N$1211: SV149.5 SV149.6 SV150.5
N$1212: SV149.7 SV149.8 SV150.7
N$1213: SV149.9 SV149.10 SV150.9
N$1214: SV149.11 SV149.12 SV150.11
N$1215: SV149.13 SV149.14 SV150.13
N$1216: SV149.15 SV149.16 SV150.15
N$1217: SV149.17 SV149.18 SV150.17
N$1218: SV149.19 SV149.20 SV150.19
N$1219: SV149.21 SV149.22 SV150.21
N$1220: SV149.23 SV149.24 SV150.23